# EAGLE design muledrum-noise (EAGLE 6.6.0)

## Sheet 1 of 6: Power
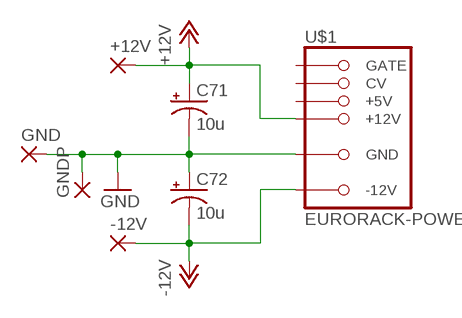
[diagram p0: schematic, sheet 1]

### Parts
+12V  2,54/1,0  [2,54/1,0]
-12V  2,54/1,0  [2,54/1,0]
C71  10u  CPOL-USE2.5-5  [E2,5-5]
C72  10u  CPOL-USE2.5-5  [E2,5-5]
GND  2,54/1,0  [2,54/1,0]
GNDP  2,54/1,0  [2,54/1,0]
U$1  EURORACK-POWER  [PINSHRD_PTH_2X8]

### Nets
+12V: +12V.1(P) C71.+ U$1.+12V@1(+12V) U$1.+12V@2(+12V) ; also sheet 2,3,4,5
-12V: -12V.1(P) C72.- U$1.-12V@1(-12V) U$1.-12V@2(-12V) ; also sheet 2,3,4,5
GND: C71.- C72.+ GND.1(P) GNDP.1(P) U$1.GND@1(GND) U$1.GND@2(GND) U$1.GND@3(GND) U$1.GND@4(GND) U$1.GND@5(GND) U$1.GND@6(GND) ; also sheet 2,3,4,5,6
Unconnected: U$1.+5V@1(+5V) U$1.+5V@2(+5V) U$1.CV@1(CV) U$1.CV@2(CV) U$1.GATE@1(GATE) U$1.GATE@2(GATE)

## Sheet 2 of 6: FNoise1
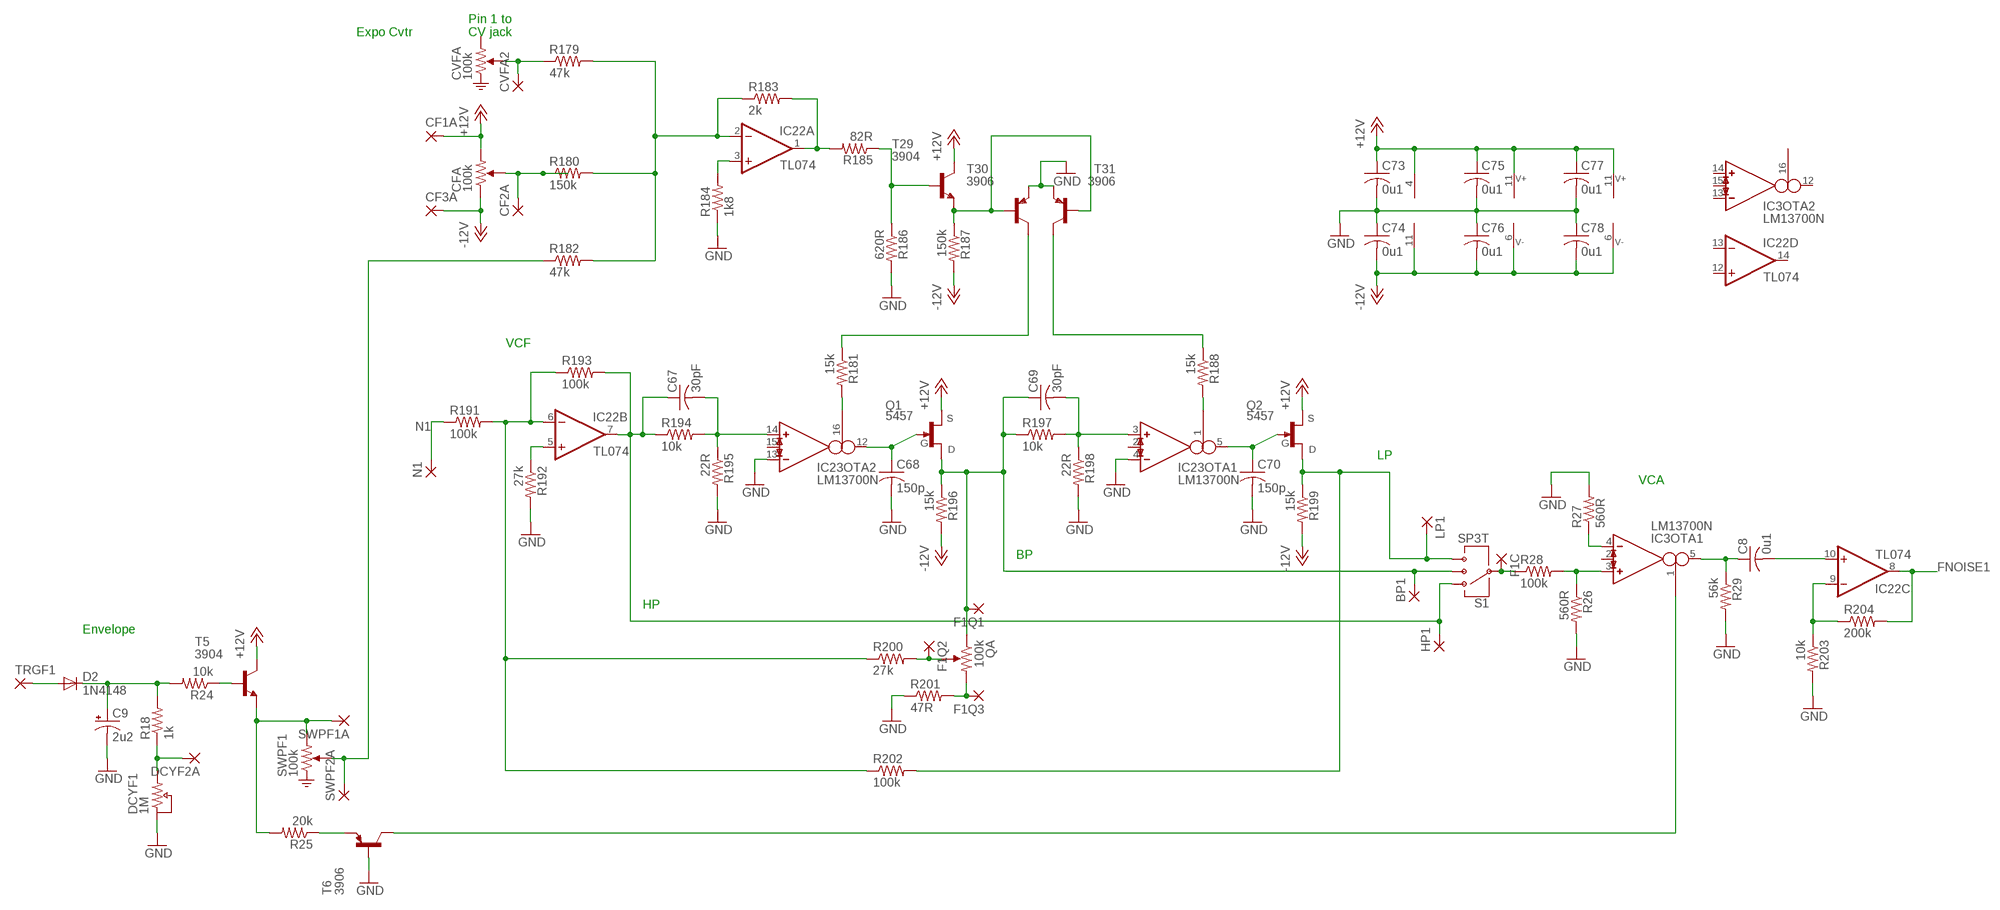
[diagram p1: schematic, sheet 2]

### Parts
BP1  2,54/1,0  [2,54/1,0]
C8  0u1  C-US050-025X075  [C050-025X075]
C9  2u2  CPOL-USE2.5-5  [E2,5-5]
C67  30pF  C-US050-025X075  [C050-025X075]
C68  150p  C-US050-025X075  [C050-025X075]
C69  30pF  C-US050-025X075  [C050-025X075]
C70  150p  C-US050-025X075  [C050-025X075]
C73  0u1  C-US050-025X075  [C050-025X075]
C74  0u1  C-US050-025X075  [C050-025X075]
C75  0u1  C-US050-025X075  [C050-025X075]
C76  0u1  C-US050-025X075  [C050-025X075]
C77  0u1  C-US050-025X075  [C050-025X075]
C78  0u1  C-US050-025X075  [C050-025X075]
CF1A  2,54/1,0  [2,54/1,0]
CF2A  2,54/1,0  [2,54/1,0]
CF3A  2,54/1,0  [2,54/1,0]
CFA  100k  POT  (no package)
CVFA  100k  POT-ATTEN  (no package)
CVFA2  2,54/1,0  [2,54/1,0]
D2  1N4148  1N4148DO35-7  [DO35-7]
DCYF1  1M  POT-RHEO  (no package)
DCYF2A  2,54/1,0  [2,54/1,0]
F1C  2,54/1,0  [2,54/1,0]
F1Q1  2,54/1,0  [2,54/1,0]
F1Q2  2,54/1,0  [2,54/1,0]
F1Q3  2,54/1,0  [2,54/1,0]
HP1  2,54/1,0  [2,54/1,0]
IC3  LM13700N  [DIL16]
IC22  TL074  TL074-TOPP  [DIL14]
IC23  LM13700N  [DIL16]
LP1  2,54/1,0  [2,54/1,0]
N1  2,54/1,0  [2,54/1,0]
Q1  5457  2N5457  [TO92-EBC]
Q2  5457  2N5457  [TO92-EBC]
QA  100k  POT  (no package)
R18  1k  R-US_0207/10  [0207/10]
R24  10k  R-US_0207/10  [0207/10]
R25  20k  R-US_0207/10  [0207/10]
R26  560R  R-US_0207/10  [0207/10]
R27  560R  R-US_0207/10  [0207/10]
R28  100k  R-US_0207/10  [0207/10]
R29  56k  R-US_0207/10  [0207/10]
R179  47k  R-US_0207/10  [0207/10]
R180  150k  R-US_0207/10  [0207/10]
R181  15k  R-US_0207/10  [0207/10]
R182  47k  R-US_0207/10  [0207/10]
R183  2k  R-US_0207/10  [0207/10]
R184  1k8  R-US_0207/10  [0207/10]
R185  82R  R-US_0207/10  [0207/10]
R186  620R  R-US_0207/10  [0207/10]
R187  150k  R-US_0207/10  [0207/10]
R188  15k  R-US_0207/10  [0207/10]
R191  100k  R-US_0207/10  [0207/10]
R192  27k  R-US_0207/10  [0207/10]
R193  100k  R-US_0207/10  [0207/10]
R194  10k  R-US_0207/10  [0207/10]
R195  22R  R-US_0207/10  [0207/10]
R196  15k  R-US_0207/10  [0207/10]
R197  10k  R-US_0207/10  [0207/10]
R198  22R  R-US_0207/10  [0207/10]
R199  15k  R-US_0207/10  [0207/10]
R200  27k  R-US_0207/10  [0207/10]
R201  47R  R-US_0207/10  [0207/10]
R202  100k  R-US_0207/10  [0207/10]
R203  10k  R-US_0207/10  [0207/10]
R204  200k  R-US_0207/10  [0207/10]
S1  SP3T  (no package)
SWPF1  100k  POT-ATTEN  (no package)
SWPF1A  2,54/1,0  [2,54/1,0]
SWPF2A  2,54/1,0  [2,54/1,0]
T5  3904  -NPN-TO92-EBC  [TO92-EBC]
T6  3906  -PNP-TO92-EBC  [TO92-EBC]
T29  3904  -NPN-TO92-EBC  [TO92-EBC]
T30  3906  -PNP-TO92-EBC  [TO92-EBC]
T31  3906  -PNP-TO92-EBC  [TO92-EBC]
TRGF1  2,54/1,0  [2,54/1,0]

### Nets
+12V: C73.1 C75.1 C77.1 CF1A.1(P) CFA.1 IC3.11 IC22.4(P:V+) IC23.11 Q1.E(S) Q2.E(S) T5.C T29.C ; also sheet 1,3,4,5
-12V: C74.2 C76.2 C78.2 CF3A.1(P) CFA.3 IC3.6 IC22.11(P:V-) IC23.6 R187.2 R196.2 R199.2 ; also sheet 1,3,4,5
FNOISE1: IC22.8(C:OUT) R204.2 ; also sheet 6
GND: C9.- C68.2 C70.2 C73.2 C74.1 C75.2 C76.1 C77.2 C78.1 DCYF1.3 IC23.4(OTA1:IN_N) IC23.13(OTA2:IN_N) R26.2 R27.2 R29.2 R184.1 R186.2 R192.2 R195.2 R198.2 R201.1 R203.2 T6.B T30.E T31.E ; also sheet 1,3,4,5,6
N1: N1.1(P) R191.1
N$29: C9.+ D2.C R18.2 R24.2
N$30: R24.1 T5.B
N$31: R25.2 SWPF1.1 SWPF1A.1(P) T5.E
N$32: R25.1 T6.E
N$33: F1C.1(P) R28.1 S1.3
N$34: IC3.3(OTA1:IN_P) R26.1 R28.2
N$35: IC3.4(OTA1:IN_N) R27.1
N$36: C8.1 IC3.5(OTA1:OUT) R29.1
N$37: D2.A TRGF1.1(P)
N$38: DCYF1.1 DCYF2A.1(P) R18.1
N$39: R182.1 SWPF1.2 SWPF2A.1(P)
N$105: CVFA2.1(P) CVFA.2 R179.1
N$223: CF2A.1(P) CFA.2 R180.1
N$224: IC22.2(A:-IN) R179.2 R180.2 R182.2 R183.1
N$225: C8.2 IC22.10(C:+IN)
N$226: IC22.1(A:OUT) R183.2 R185.2
N$227: IC22.3(A:+IN) R184.2
N$230: R185.1 R186.1 T29.B
N$231: R187.1 T29.E T30.B T31.B
N$232: R181.1 T30.C
N$233: R188.1 T31.C
N$235: IC22.6(B:-IN) R191.2 R193.1 R200.1 R202.1
N$236: IC22.5(B:+IN) R192.1
N$237: IC3.1(OTA1:I_BIAS) T6.C
N$238: C67.2 IC23.14(OTA2:IN_P) R194.2 R195.1
N$239: C68.1 IC23.12(OTA2:OUT) Q1.C(G)
N$240: C70.1 IC23.5(OTA1:OUT) Q2.C(G)
N$241: IC23.16(OTA2:I_BIAS) R181.2
N$242: IC22.9(C:-IN) R203.1 R204.1
N$243: C69.2 IC23.3(OTA1:IN_P) R197.2 R198.1
N$245: IC23.1(OTA1:I_BIAS) R188.2
N$246: F1Q2.1(P) QA.2 R200.2
N$247: F1Q3.1(P) QA.1 R201.2
N$248: C67.1 HP1.1(P) IC22.7(B:OUT) R193.2 R194.1 S1.1
N$249: BP1.1(P) C69.1 F1Q1.1(P) Q1.B(D) QA.3 R196.1 R197.1 S1.2
N$250: LP1.1(P) Q2.B(D) R199.1 R202.2 S1.4
Unconnected: CVFA.1 IC3.2(OTA1:I_DIODE) IC3.7(BUF1:B) IC3.8(BUF1:E) IC3.9(BUF2:E) IC3.10(BUF2:B) IC3.12(OTA2:OUT) IC3.13(OTA2:IN_N) IC3.14(OTA2:IN_P) IC3.15(OTA2:I_DIODE) IC3.16(OTA2:I_BIAS) IC22.12(D:+IN) IC22.13(D:-IN) IC22.14(D:OUT) IC23.2(OTA1:I_DIODE) IC23.7(BUF1:B) IC23.8(BUF1:E) IC23.9(BUF2:E) IC23.10(BUF2:B) IC23.15(OTA2:I_DIODE)

### Notes on the sheet
- Expo Cvtr
- Pin 1 to
  CV jack
- VCF
- LP
- VCA
- BP
- HP
- Envelope

## Sheet 3 of 6: FNoise2
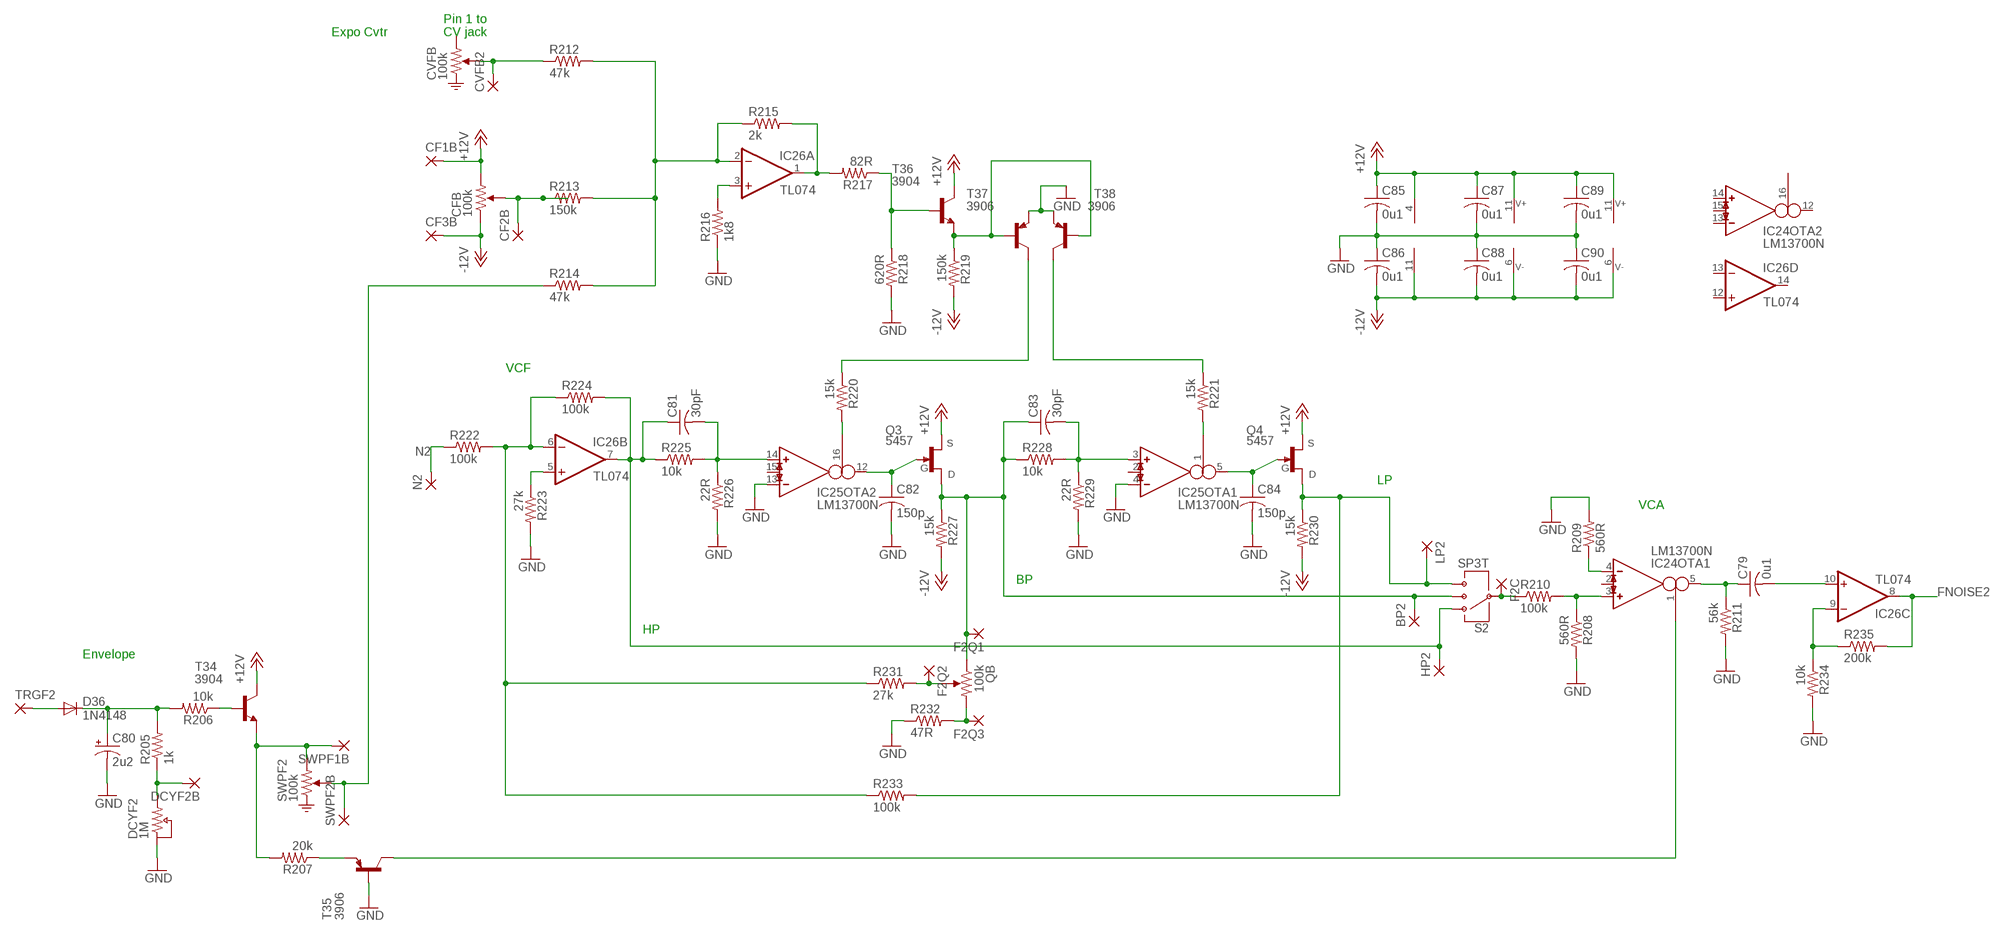
[diagram p2: schematic, sheet 3]

### Parts
BP2  2,54/1,0  [2,54/1,0]
C79  0u1  C-US050-025X075  [C050-025X075]
C80  2u2  CPOL-USE2.5-5  [E2,5-5]
C81  30pF  C-US050-025X075  [C050-025X075]
C82  150p  C-US050-025X075  [C050-025X075]
C83  30pF  C-US050-025X075  [C050-025X075]
C84  150p  C-US050-025X075  [C050-025X075]
C85  0u1  C-US050-025X075  [C050-025X075]
C86  0u1  C-US050-025X075  [C050-025X075]
C87  0u1  C-US050-025X075  [C050-025X075]
C88  0u1  C-US050-025X075  [C050-025X075]
C89  0u1  C-US050-025X075  [C050-025X075]
C90  0u1  C-US050-025X075  [C050-025X075]
CF1B  2,54/1,0  [2,54/1,0]
CF2B  2,54/1,0  [2,54/1,0]
CF3B  2,54/1,0  [2,54/1,0]
CFB  100k  POT  (no package)
CVFB  100k  POT-ATTEN  (no package)
CVFB2  2,54/1,0  [2,54/1,0]
D36  1N4148  1N4148DO35-7  [DO35-7]
DCYF2  1M  POT-RHEO  (no package)
DCYF2B  2,54/1,0  [2,54/1,0]
F2C  2,54/1,0  [2,54/1,0]
F2Q1  2,54/1,0  [2,54/1,0]
F2Q2  2,54/1,0  [2,54/1,0]
F2Q3  2,54/1,0  [2,54/1,0]
HP2  2,54/1,0  [2,54/1,0]
IC24  LM13700N  [DIL16]
IC25  LM13700N  [DIL16]
IC26  TL074  TL074-TOPP  [DIL14]
LP2  2,54/1,0  [2,54/1,0]
N2  2,54/1,0  [2,54/1,0]
Q3  5457  2N5457  [TO92-EBC]
Q4  5457  2N5457  [TO92-EBC]
QB  100k  POT  (no package)
R205  1k  R-US_0207/10  [0207/10]
R206  10k  R-US_0207/10  [0207/10]
R207  20k  R-US_0207/10  [0207/10]
R208  560R  R-US_0207/10  [0207/10]
R209  560R  R-US_0207/10  [0207/10]
R210  100k  R-US_0207/10  [0207/10]
R211  56k  R-US_0207/10  [0207/10]
R212  47k  R-US_0207/10  [0207/10]
R213  150k  R-US_0207/10  [0207/10]
R214  47k  R-US_0207/10  [0207/10]
R215  2k  R-US_0207/10  [0207/10]
R216  1k8  R-US_0207/10  [0207/10]
R217  82R  R-US_0207/10  [0207/10]
R218  620R  R-US_0207/10  [0207/10]
R219  150k  R-US_0207/10  [0207/10]
R220  15k  R-US_0207/10  [0207/10]
R221  15k  R-US_0207/10  [0207/10]
R222  100k  R-US_0207/10  [0207/10]
R223  27k  R-US_0207/10  [0207/10]
R224  100k  R-US_0207/10  [0207/10]
R225  10k  R-US_0207/10  [0207/10]
R226  22R  R-US_0207/10  [0207/10]
R227  15k  R-US_0207/10  [0207/10]
R228  10k  R-US_0207/10  [0207/10]
R229  22R  R-US_0207/10  [0207/10]
R230  15k  R-US_0207/10  [0207/10]
R231  27k  R-US_0207/10  [0207/10]
R232  47R  R-US_0207/10  [0207/10]
R233  100k  R-US_0207/10  [0207/10]
R234  10k  R-US_0207/10  [0207/10]
R235  200k  R-US_0207/10  [0207/10]
S2  SP3T  (no package)
SWPF1B  2,54/1,0  [2,54/1,0]
SWPF2  100k  POT-ATTEN  (no package)
SWPF2B  2,54/1,0  [2,54/1,0]
T34  3904  -NPN-TO92-EBC  [TO92-EBC]
T35  3906  -PNP-TO92-EBC  [TO92-EBC]
T36  3904  -NPN-TO92-EBC  [TO92-EBC]
T37  3906  -PNP-TO92-EBC  [TO92-EBC]
T38  3906  -PNP-TO92-EBC  [TO92-EBC]
TRGF2  2,54/1,0  [2,54/1,0]

### Nets
+12V: C85.1 C87.1 C89.1 CF1B.1(P) CFB.1 IC24.11 IC25.11 IC26.4(P:V+) Q3.E(S) Q4.E(S) T34.C T36.C ; also sheet 1,2,4,5
-12V: C86.2 C88.2 C90.2 CF3B.1(P) CFB.3 IC24.6 IC25.6 IC26.11(P:V-) R219.2 R227.2 R230.2 ; also sheet 1,2,4,5
FNOISE2: IC26.8(C:OUT) R235.2 ; also sheet 6
GND: C80.- C82.2 C84.2 C85.2 C86.1 C87.2 C88.1 C89.2 C90.1 DCYF2.3 IC25.4(OTA1:IN_N) IC25.13(OTA2:IN_N) R208.2 R209.2 R211.2 R216.1 R218.2 R223.2 R226.2 R229.2 R232.1 R234.2 T35.B T37.E T38.E ; also sheet 1,2,4,5,6
N2: N2.1(P) R222.1
N$106: CVFB2.1(P) CVFB.2 R212.1
N$255: C80.+ D36.C R205.2 R206.2
N$256: R206.1 T34.B
N$257: R207.2 SWPF1B.1(P) SWPF2.1 T34.E
N$258: R207.1 T35.E
N$259: IC24.3(OTA1:IN_P) R208.1 R210.2
N$260: IC24.4(OTA1:IN_N) R209.1
N$261: C79.1 IC24.5(OTA1:OUT) R211.1
N$262: D36.A TRGF2.1(P)
N$263: DCYF2.1 DCYF2B.1(P) R205.1
N$264: R214.1 SWPF2.2 SWPF2B.1(P)
N$266: IC26.2(A:-IN) R212.2 R213.2 R214.2 R215.1
N$267: IC26.1(A:OUT) R215.2 R217.2
N$268: IC26.3(A:+IN) R216.2
N$269: R217.1 R218.1 T36.B
N$270: R219.1 T36.E T37.B T38.B
N$271: R220.1 T37.C
N$272: R221.1 T38.C
N$273: CF2B.1(P) CFB.2 R213.1
N$274: IC26.6(B:-IN) R222.2 R224.1 R231.1 R233.1
N$275: IC26.5(B:+IN) R223.1
N$276: C81.2 IC25.14(OTA2:IN_P) R225.2 R226.1
N$277: C82.1 IC25.12(OTA2:OUT) Q3.C(G)
N$278: IC25.16(OTA2:I_BIAS) R220.2
N$279: C83.2 IC25.3(OTA1:IN_P) R228.2 R229.1
N$280: C84.1 IC25.5(OTA1:OUT) Q4.C(G)
N$281: IC25.1(OTA1:I_BIAS) R221.2
N$282: F2Q2.1(P) QB.2 R231.2
N$283: F2Q3.1(P) QB.1 R232.2
N$284: C81.1 HP2.1(P) IC26.7(B:OUT) R224.2 R225.1 S2.1
N$285: BP2.1(P) C83.1 F2Q1.1(P) Q3.B(D) QB.3 R227.1 R228.1 S2.2
N$286: LP2.1(P) Q4.B(D) R230.1 R233.2 S2.4
N$287: F2C.1(P) R210.1 S2.3
N$288: IC24.1(OTA1:I_BIAS) T35.C
N$289: C79.2 IC26.10(C:+IN)
N$290: IC26.9(C:-IN) R234.1 R235.1
Unconnected: CVFB.1 IC24.2(OTA1:I_DIODE) IC24.7(BUF1:B) IC24.8(BUF1:E) IC24.9(BUF2:E) IC24.10(BUF2:B) IC24.12(OTA2:OUT) IC24.13(OTA2:IN_N) IC24.14(OTA2:IN_P) IC24.15(OTA2:I_DIODE) IC24.16(OTA2:I_BIAS) IC25.2(OTA1:I_DIODE) IC25.7(BUF1:B) IC25.8(BUF1:E) IC25.9(BUF2:E) IC25.10(BUF2:B) IC25.15(OTA2:I_DIODE) IC26.12(D:+IN) IC26.13(D:-IN) IC26.14(D:OUT)

### Notes on the sheet
- Expo Cvtr
- Pin 1 to
  CV jack
- VCF
- LP
- VCA
- BP
- HP
- Envelope

## Sheet 4 of 6: FNoise3
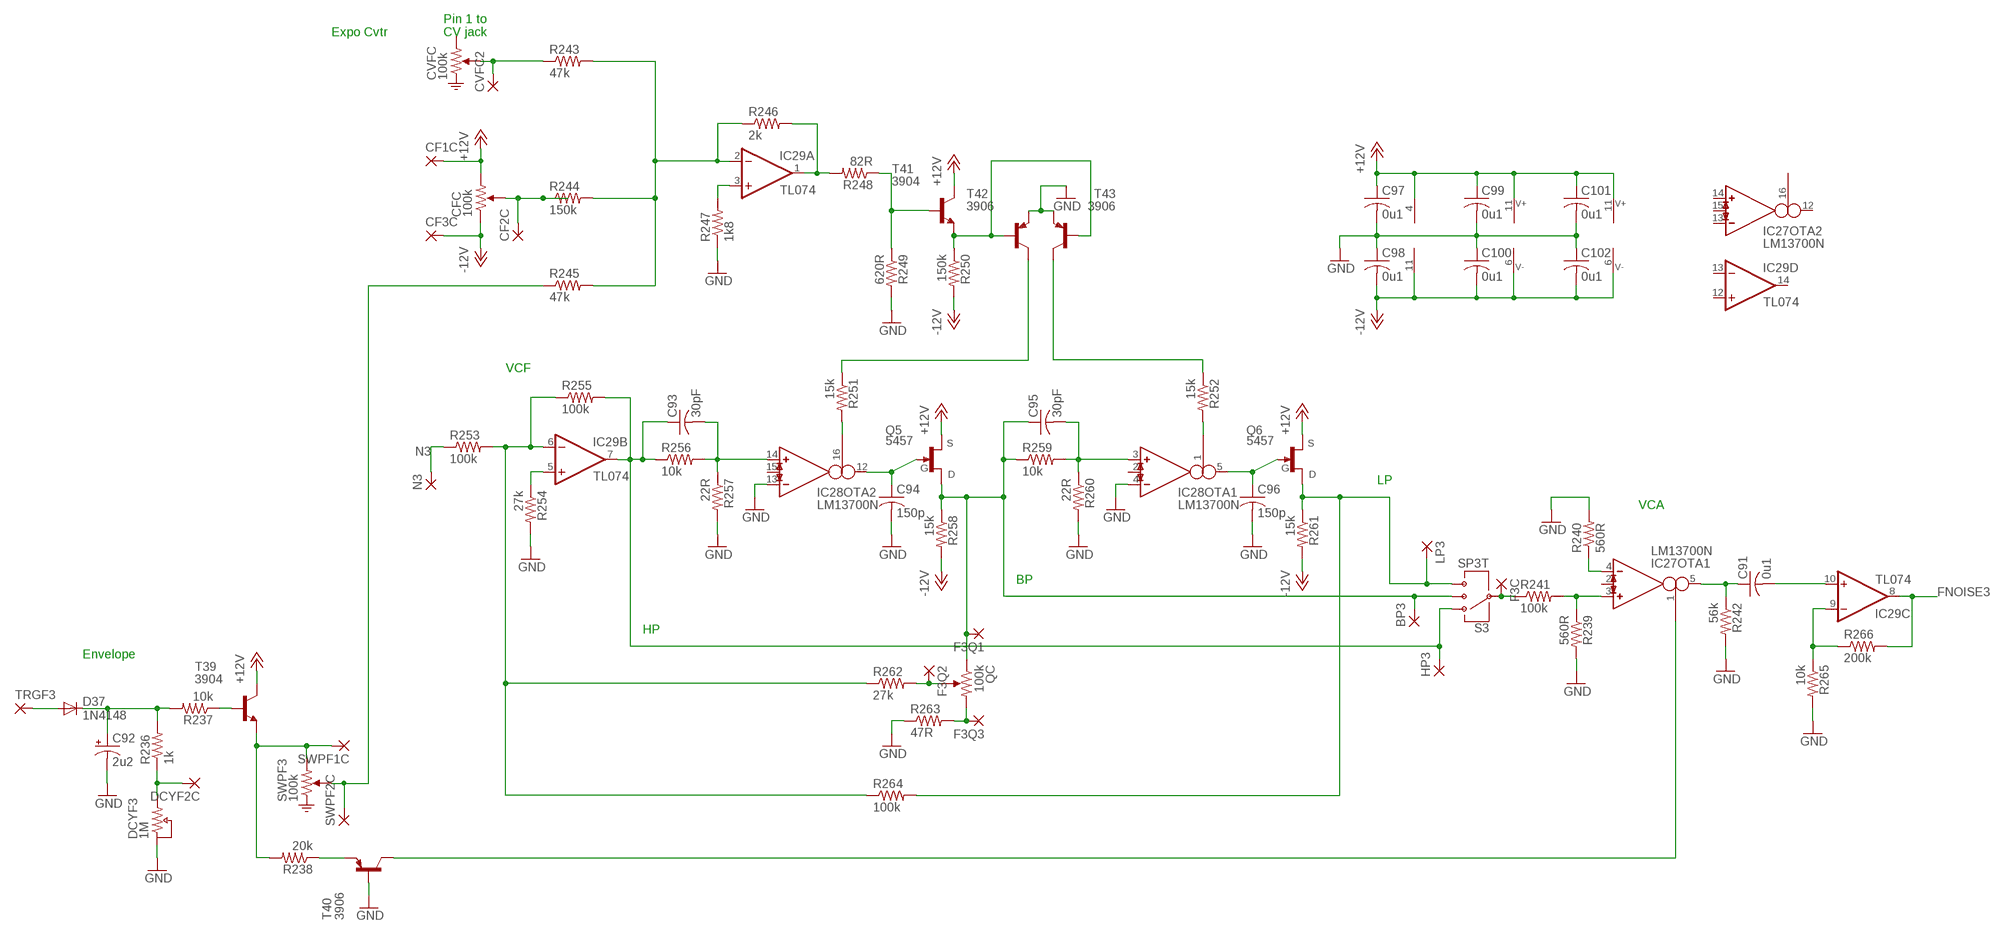
[diagram p3: schematic, sheet 4]

### Parts
BP3  2,54/1,0  [2,54/1,0]
C91  0u1  C-US050-025X075  [C050-025X075]
C92  2u2  CPOL-USE2.5-5  [E2,5-5]
C93  30pF  C-US050-025X075  [C050-025X075]
C94  150p  C-US050-025X075  [C050-025X075]
C95  30pF  C-US050-025X075  [C050-025X075]
C96  150p  C-US050-025X075  [C050-025X075]
C97  0u1  C-US050-025X075  [C050-025X075]
C98  0u1  C-US050-025X075  [C050-025X075]
C99  0u1  C-US050-025X075  [C050-025X075]
C100  0u1  C-US050-025X075  [C050-025X075]
C101  0u1  C-US050-025X075  [C050-025X075]
C102  0u1  C-US050-025X075  [C050-025X075]
CF1C  2,54/1,0  [2,54/1,0]
CF2C  2,54/1,0  [2,54/1,0]
CF3C  2,54/1,0  [2,54/1,0]
CFC  100k  POT  (no package)
CVFC  100k  POT-ATTEN  (no package)
CVFC2  2,54/1,0  [2,54/1,0]
D37  1N4148  1N4148DO35-7  [DO35-7]
DCYF2C  2,54/1,0  [2,54/1,0]
DCYF3  1M  POT-RHEO  (no package)
F3C  2,54/1,0  [2,54/1,0]
F3Q1  2,54/1,1  [2,54/1,1]
F3Q2  2,54/1,1  [2,54/1,1]
F3Q3  2,54/1,1  [2,54/1,1]
HP3  2,54/1,0  [2,54/1,0]
IC27  LM13700N  [DIL16]
IC28  LM13700N  [DIL16]
IC29  TL074  TL074-TOPP  [DIL14]
LP3  2,54/1,0  [2,54/1,0]
N3  2,54/1,0  [2,54/1,0]
Q5  5457  2N5457  [TO92-EBC]
Q6  5457  2N5457  [TO92-EBC]
QC  100k  POT  (no package)
R236  1k  R-US_0207/10  [0207/10]
R237  10k  R-US_0207/10  [0207/10]
R238  20k  R-US_0207/10  [0207/10]
R239  560R  R-US_0207/10  [0207/10]
R240  560R  R-US_0207/10  [0207/10]
R241  100k  R-US_0207/10  [0207/10]
R242  56k  R-US_0207/10  [0207/10]
R243  47k  R-US_0207/10  [0207/10]
R244  150k  R-US_0207/10  [0207/10]
R245  47k  R-US_0207/10  [0207/10]
R246  2k  R-US_0207/10  [0207/10]
R247  1k8  R-US_0207/10  [0207/10]
R248  82R  R-US_0207/10  [0207/10]
R249  620R  R-US_0207/10  [0207/10]
R250  150k  R-US_0207/10  [0207/10]
R251  15k  R-US_0207/10  [0207/10]
R252  15k  R-US_0207/10  [0207/10]
R253  100k  R-US_0207/10  [0207/10]
R254  27k  R-US_0207/10  [0207/10]
R255  100k  R-US_0207/10  [0207/10]
R256  10k  R-US_0207/10  [0207/10]
R257  22R  R-US_0207/10  [0207/10]
R258  15k  R-US_0207/10  [0207/10]
R259  10k  R-US_0207/10  [0207/10]
R260  22R  R-US_0207/10  [0207/10]
R261  15k  R-US_0207/10  [0207/10]
R262  27k  R-US_0207/10  [0207/10]
R263  47R  R-US_0207/10  [0207/10]
R264  100k  R-US_0207/10  [0207/10]
R265  10k  R-US_0207/10  [0207/10]
R266  200k  R-US_0207/10  [0207/10]
S3  SP3T  (no package)
SWPF1C  2,54/1,0  [2,54/1,0]
SWPF2C  2,54/1,0  [2,54/1,0]
SWPF3  100k  POT-ATTEN  (no package)
T39  3904  -NPN-TO92-EBC  [TO92-EBC]
T40  3906  -PNP-TO92-EBC  [TO92-EBC]
T41  3904  -NPN-TO92-EBC  [TO92-EBC]
T42  3906  -PNP-TO92-EBC  [TO92-EBC]
T43  3906  -PNP-TO92-EBC  [TO92-EBC]
TRGF3  2,54/1,0  [2,54/1,0]

### Nets
+12V: C97.1 C99.1 C101.1 CF1C.1(P) CFC.1 IC27.11 IC28.11 IC29.4(P:V+) Q5.E(S) Q6.E(S) T39.C T41.C ; also sheet 1,2,3,5
-12V: C98.2 C100.2 C102.2 CF3C.1(P) CFC.3 IC27.6 IC28.6 IC29.11(P:V-) R250.2 R258.2 R261.2 ; also sheet 1,2,3,5
FNOISE3: IC29.8(C:OUT) R266.2 ; also sheet 6
GND: C92.- C94.2 C96.2 C97.2 C98.1 C99.2 C100.1 C101.2 C102.1 DCYF3.3 IC28.4(OTA1:IN_N) IC28.13(OTA2:IN_N) R239.2 R240.2 R242.2 R247.1 R249.2 R254.2 R257.2 R260.2 R263.1 R265.2 T40.B T42.E T43.E ; also sheet 1,2,3,5,6
N3: N3.1(P) R253.1
N$107: CVFC2.1(P) CVFC.2 R243.1
N$244: C92.+ D37.C R236.2 R237.2
N$251: R237.1 T39.B
N$252: R238.2 SWPF1C.1(P) SWPF3.1 T39.E
N$253: R238.1 T40.E
N$254: IC27.3(OTA1:IN_P) R239.1 R241.2
N$291: IC27.4(OTA1:IN_N) R240.1
N$292: C91.1 IC27.5(OTA1:OUT) R242.1
N$293: D37.A TRGF3.1(P)
N$294: DCYF2C.1(P) DCYF3.1 R236.1
N$295: R245.1 SWPF2C.1(P) SWPF3.2
N$297: IC29.2(A:-IN) R243.2 R244.2 R245.2 R246.1
N$298: IC29.1(A:OUT) R246.2 R248.2
N$299: IC29.3(A:+IN) R247.2
N$300: R248.1 R249.1 T41.B
N$301: R250.1 T41.E T42.B T43.B
N$302: R251.1 T42.C
N$303: R252.1 T43.C
N$304: CF2C.1(P) CFC.2 R244.1
N$305: IC29.6(B:-IN) R253.2 R255.1 R262.1 R264.1
N$306: IC29.5(B:+IN) R254.1
N$307: C93.2 IC28.14(OTA2:IN_P) R256.2 R257.1
N$308: C94.1 IC28.12(OTA2:OUT) Q5.C(G)
N$309: IC28.16(OTA2:I_BIAS) R251.2
N$310: C95.2 IC28.3(OTA1:IN_P) R259.2 R260.1
N$311: C96.1 IC28.5(OTA1:OUT) Q6.C(G)
N$312: IC28.1(OTA1:I_BIAS) R252.2
N$313: F3Q2.1(P) QC.2 R262.2
N$314: F3Q3.1(P) QC.1 R263.2
N$315: C93.1 HP3.1(P) IC29.7(B:OUT) R255.2 R256.1 S3.1
N$316: BP3.1(P) C95.1 F3Q1.1(P) Q5.B(D) QC.3 R258.1 R259.1 S3.2
N$317: LP3.1(P) Q6.B(D) R261.1 R264.2 S3.4
N$318: F3C.1(P) R241.1 S3.3
N$319: IC27.1(OTA1:I_BIAS) T40.C
N$320: C91.2 IC29.10(C:+IN)
N$321: IC29.9(C:-IN) R265.1 R266.1
Unconnected: CVFC.1 IC27.2(OTA1:I_DIODE) IC27.7(BUF1:B) IC27.8(BUF1:E) IC27.9(BUF2:E) IC27.10(BUF2:B) IC27.12(OTA2:OUT) IC27.13(OTA2:IN_N) IC27.14(OTA2:IN_P) IC27.15(OTA2:I_DIODE) IC27.16(OTA2:I_BIAS) IC28.2(OTA1:I_DIODE) IC28.7(BUF1:B) IC28.8(BUF1:E) IC28.9(BUF2:E) IC28.10(BUF2:B) IC28.15(OTA2:I_DIODE) IC29.12(D:+IN) IC29.13(D:-IN) IC29.14(D:OUT)

### Notes on the sheet
- Expo Cvtr
- Pin 1 to
  CV jack
- VCF
- LP
- VCA
- BP
- HP
- Envelope

## Sheet 5 of 6: FNoise4
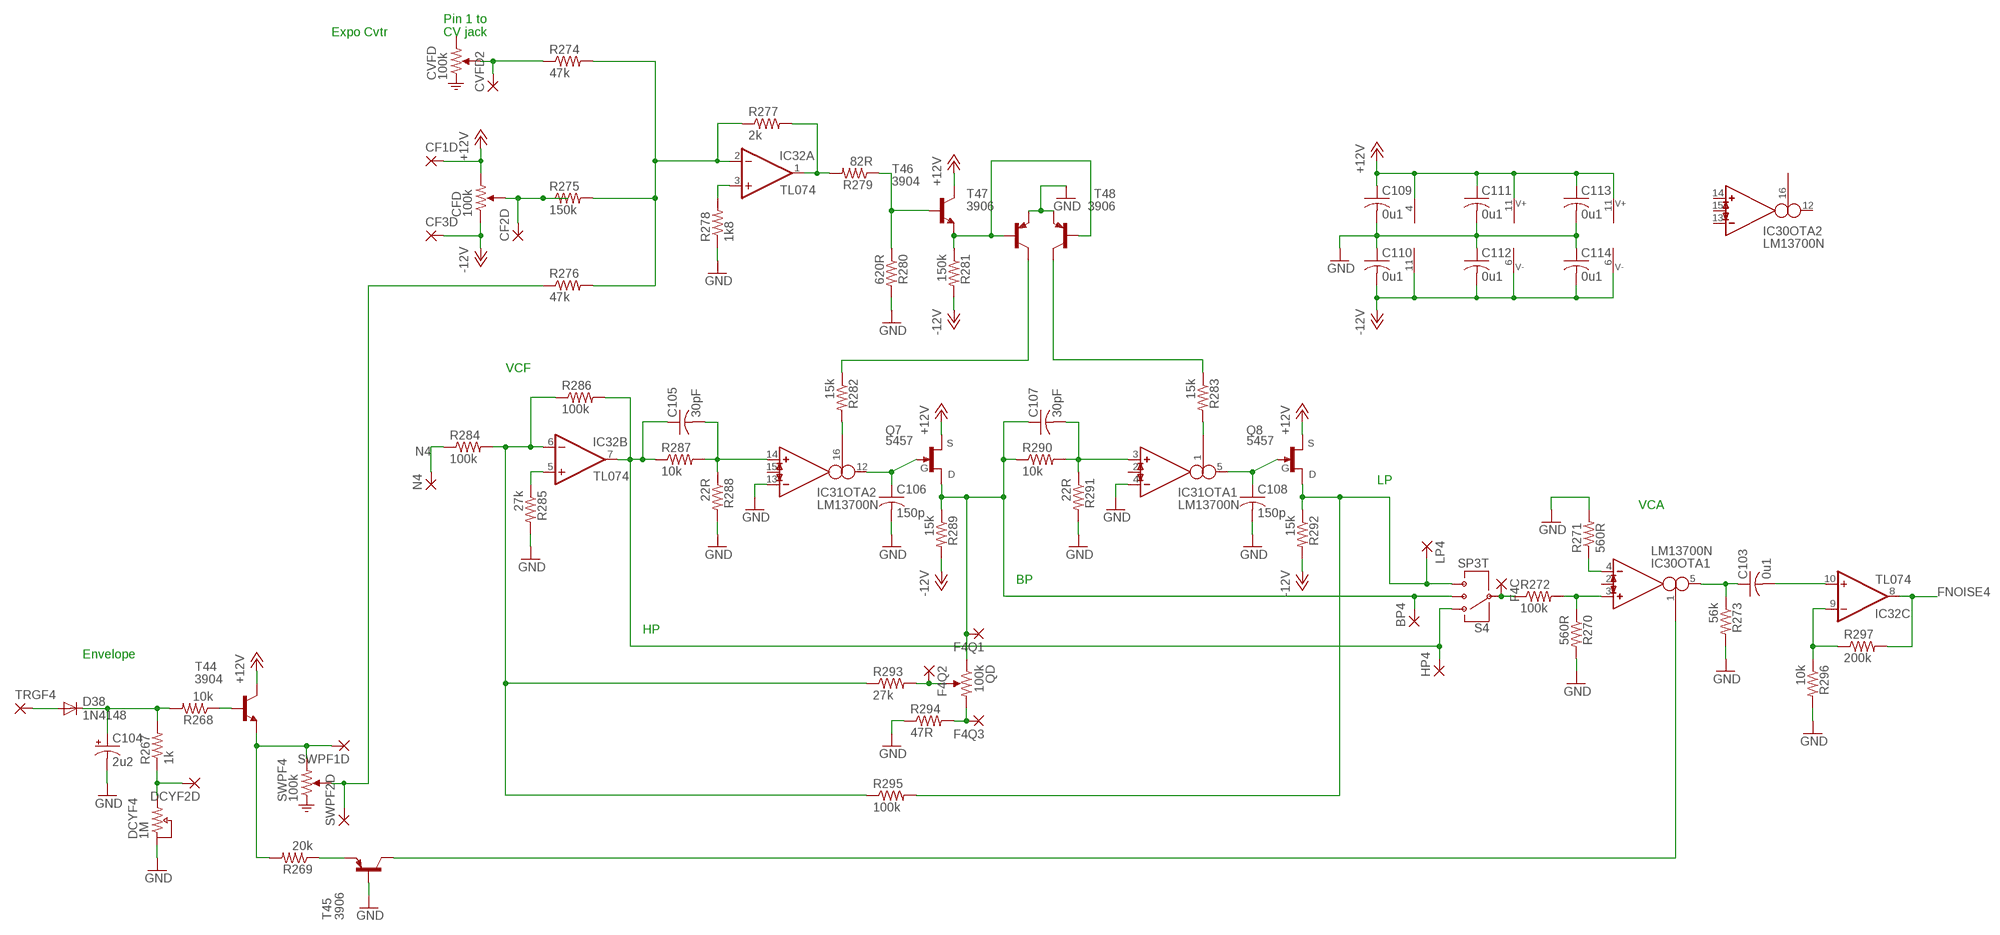
[diagram p4: schematic, sheet 5]

### Parts
BP4  2,54/1,0  [2,54/1,0]
C103  0u1  C-US050-025X075  [C050-025X075]
C104  2u2  CPOL-USE2.5-5  [E2,5-5]
C105  30pF  C-US050-025X075  [C050-025X075]
C106  150p  C-US050-025X075  [C050-025X075]
C107  30pF  C-US050-025X075  [C050-025X075]
C108  150p  C-US050-025X075  [C050-025X075]
C109  0u1  C-US050-025X075  [C050-025X075]
C110  0u1  C-US050-025X075  [C050-025X075]
C111  0u1  C-US050-025X075  [C050-025X075]
C112  0u1  C-US050-025X075  [C050-025X075]
C113  0u1  C-US050-025X075  [C050-025X075]
C114  0u1  C-US050-025X075  [C050-025X075]
CF1D  2,54/1,0  [2,54/1,0]
CF2D  2,54/1,0  [2,54/1,0]
CF3D  2,54/1,0  [2,54/1,0]
CFD  100k  POT  (no package)
CVFD  100k  POT-ATTEN  (no package)
CVFD2  2,54/1,0  [2,54/1,0]
D38  1N4148  1N4148DO35-7  [DO35-7]
DCYF2D  2,54/1,0  [2,54/1,0]
DCYF4  1M  POT-RHEO  (no package)
F4C  2,54/1,0  [2,54/1,0]
F4Q1  2,54/1,0  [2,54/1,0]
F4Q2  2,54/1,0  [2,54/1,0]
F4Q3  2,54/1,0  [2,54/1,0]
HP4  2,54/1,0  [2,54/1,0]
IC30  LM13700N  [DIL16]
IC31  LM13700N  [DIL16]
IC32  TL074  TL074-TOPP  [DIL14]
LP4  2,54/1,0  [2,54/1,0]
N4  2,54/1,0  [2,54/1,0]
Q7  5457  2N5457  [TO92-EBC]
Q8  5457  2N5457  [TO92-EBC]
QD  100k  POT  (no package)
R267  1k  R-US_0207/10  [0207/10]
R268  10k  R-US_0207/10  [0207/10]
R269  20k  R-US_0207/10  [0207/10]
R270  560R  R-US_0207/10  [0207/10]
R271  560R  R-US_0207/10  [0207/10]
R272  100k  R-US_0207/10  [0207/10]
R273  56k  R-US_0207/10  [0207/10]
R274  47k  R-US_0207/10  [0207/10]
R275  150k  R-US_0207/10  [0207/10]
R276  47k  R-US_0207/10  [0207/10]
R277  2k  R-US_0207/10  [0207/10]
R278  1k8  R-US_0207/10  [0207/10]
R279  82R  R-US_0207/10  [0207/10]
R280  620R  R-US_0207/10  [0207/10]
R281  150k  R-US_0207/10  [0207/10]
R282  15k  R-US_0207/10  [0207/10]
R283  15k  R-US_0207/10  [0207/10]
R284  100k  R-US_0207/10  [0207/10]
R285  27k  R-US_0207/10  [0207/10]
R286  100k  R-US_0207/10  [0207/10]
R287  10k  R-US_0207/10  [0207/10]
R288  22R  R-US_0207/10  [0207/10]
R289  15k  R-US_0207/10  [0207/10]
R290  10k  R-US_0207/10  [0207/10]
R291  22R  R-US_0207/10  [0207/10]
R292  15k  R-US_0207/10  [0207/10]
R293  27k  R-US_0207/10  [0207/10]
R294  47R  R-US_0207/10  [0207/10]
R295  100k  R-US_0207/10  [0207/10]
R296  10k  R-US_0207/10  [0207/10]
R297  200k  R-US_0207/10  [0207/10]
S4  SP3T  (no package)
SWPF1D  2,54/1,0  [2,54/1,0]
SWPF2D  2,54/1,0  [2,54/1,0]
SWPF4  100k  POT-ATTEN  (no package)
T44  3904  -NPN-TO92-EBC  [TO92-EBC]
T45  3906  -PNP-TO92-EBC  [TO92-EBC]
T46  3904  -NPN-TO92-EBC  [TO92-EBC]
T47  3906  -PNP-TO92-EBC  [TO92-EBC]
T48  3906  -PNP-TO92-EBC  [TO92-EBC]
TRGF4  2,54/1,0  [2,54/1,0]

### Nets
+12V: C109.1 C111.1 C113.1 CF1D.1(P) CFD.1 IC30.11 IC31.11 IC32.4(P:V+) Q7.E(S) Q8.E(S) T44.C T46.C ; also sheet 1,2,3,4
-12V: C110.2 C112.2 C114.2 CF3D.1(P) CFD.3 IC30.6 IC31.6 IC32.11(P:V-) R281.2 R289.2 R292.2 ; also sheet 1,2,3,4
FNOISE4: IC32.8(C:OUT) R297.2 ; also sheet 6
GND: C104.- C106.2 C108.2 C109.2 C110.1 C111.2 C112.1 C113.2 C114.1 DCYF4.3 IC31.4(OTA1:IN_N) IC31.13(OTA2:IN_N) R270.2 R271.2 R273.2 R278.1 R280.2 R285.2 R288.2 R291.2 R294.1 R296.2 T45.B T47.E T48.E ; also sheet 1,2,3,4,6
N4: N4.1(P) R284.1
N$108: CVFD2.1(P) CVFD.2 R274.1
N$322: C104.+ D38.C R267.2 R268.2
N$323: R268.1 T44.B
N$324: R269.2 SWPF1D.1(P) SWPF4.1 T44.E
N$325: R269.1 T45.E
N$326: IC30.3(OTA1:IN_P) R270.1 R272.2
N$327: IC30.4(OTA1:IN_N) R271.1
N$328: C103.1 IC30.5(OTA1:OUT) R273.1
N$329: D38.A TRGF4.1(P)
N$330: DCYF2D.1(P) DCYF4.1 R267.1
N$331: R276.1 SWPF2D.1(P) SWPF4.2
N$333: IC32.2(A:-IN) R274.2 R275.2 R276.2 R277.1
N$334: IC32.1(A:OUT) R277.2 R279.2
N$335: IC32.3(A:+IN) R278.2
N$336: R279.1 R280.1 T46.B
N$337: R281.1 T46.E T47.B T48.B
N$338: R282.1 T47.C
N$339: R283.1 T48.C
N$340: CF2D.1(P) CFD.2 R275.1
N$341: IC32.6(B:-IN) R284.2 R286.1 R293.1 R295.1
N$342: IC32.5(B:+IN) R285.1
N$343: C105.2 IC31.14(OTA2:IN_P) R287.2 R288.1
N$344: C106.1 IC31.12(OTA2:OUT) Q7.C(G)
N$345: IC31.16(OTA2:I_BIAS) R282.2
N$346: C107.2 IC31.3(OTA1:IN_P) R290.2 R291.1
N$347: C108.1 IC31.5(OTA1:OUT) Q8.C(G)
N$348: IC31.1(OTA1:I_BIAS) R283.2
N$349: F4Q2.1(P) QD.2 R293.2
N$350: F4Q3.1(P) QD.1 R294.2
N$351: C105.1 HP4.1(P) IC32.7(B:OUT) R286.2 R287.1 S4.1
N$352: BP4.1(P) C107.1 F4Q1.1(P) Q7.B(D) QD.3 R289.1 R290.1 S4.2
N$353: LP4.1(P) Q8.B(D) R292.1 R295.2 S4.4
N$354: F4C.1(P) R272.1 S4.3
N$355: IC30.1(OTA1:I_BIAS) T45.C
N$356: C103.2 IC32.10(C:+IN)
N$357: IC32.9(C:-IN) R296.1 R297.1
Unconnected: CVFD.1 IC30.2(OTA1:I_DIODE) IC30.7(BUF1:B) IC30.8(BUF1:E) IC30.9(BUF2:E) IC30.10(BUF2:B) IC30.12(OTA2:OUT) IC30.13(OTA2:IN_N) IC30.14(OTA2:IN_P) IC30.15(OTA2:I_DIODE) IC30.16(OTA2:I_BIAS) IC31.2(OTA1:I_DIODE) IC31.7(BUF1:B) IC31.8(BUF1:E) IC31.9(BUF2:E) IC31.10(BUF2:B) IC31.15(OTA2:I_DIODE)

### Notes on the sheet
- Expo Cvtr
- Pin 1 to
  CV jack
- VCF
- LP
- VCA
- BP
- HP
- Envelope

## Sheet 6 of 6: Mixer
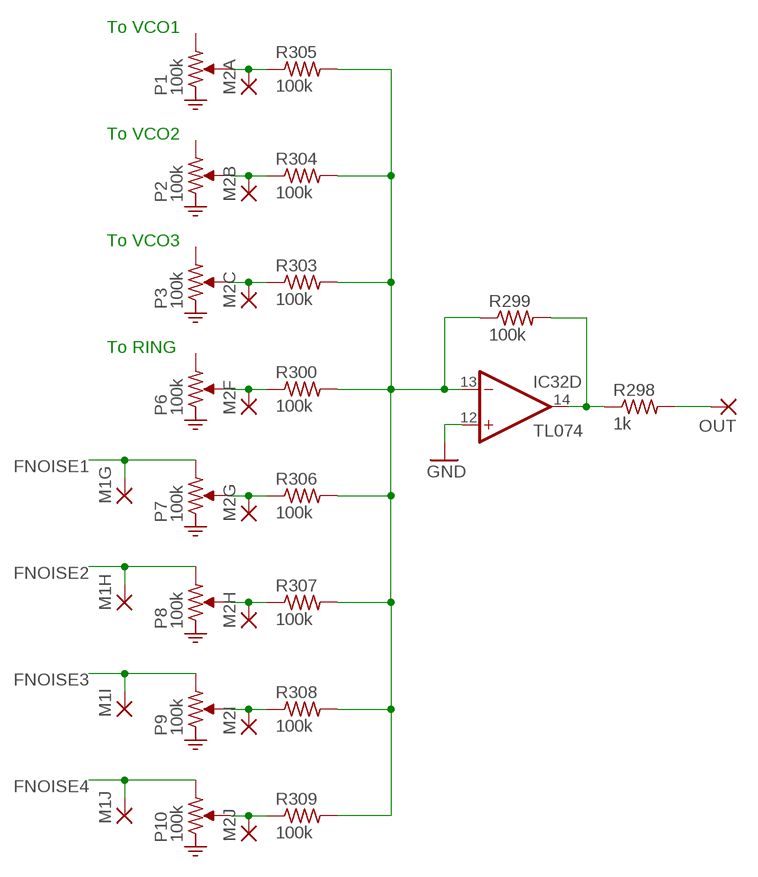
[diagram p5: schematic, sheet 6]

### Parts
M1G  2,54/1,0  [2,54/1,0]
M1H  2,54/1,0  [2,54/1,0]
M1I  2,54/1,0  [2,54/1,0]
M1J  2,54/1,0  [2,54/1,0]
M2A  2,54/1,0  [2,54/1,0]
M2B  2,54/1,0  [2,54/1,0]
M2C  2,54/1,0  [2,54/1,0]
M2F  2,54/1,0  [2,54/1,0]
M2G  2,54/1,0  [2,54/1,0]
M2H  2,54/1,0  [2,54/1,0]
M2I  2,54/1,0  [2,54/1,0]
M2J  2,54/1,0  [2,54/1,0]
OUT  2,54/1,0  [2,54/1,0]
P1  100k  POT-ATTEN  (no package)
P2  100k  POT-ATTEN  (no package)
P3  100k  POT-ATTEN  (no package)
P6  100k  POT-ATTEN  (no package)
P7  100k  POT-ATTEN  (no package)
P8  100k  POT-ATTEN  (no package)
P9  100k  POT-ATTEN  (no package)
P10  100k  POT-ATTEN  (no package)
R298  1k  R-US_0207/10  [0207/10]
R299  100k  R-US_0207/10  [0207/10]
R300  100k  R-US_0207/10  [0207/10]
R303  100k  R-US_0207/10  [0207/10]
R304  100k  R-US_0207/10  [0207/10]
R305  100k  R-US_0207/10  [0207/10]
R306  100k  R-US_0207/10  [0207/10]
R307  100k  R-US_0207/10  [0207/10]
R308  100k  R-US_0207/10  [0207/10]
R309  100k  R-US_0207/10  [0207/10]

### Nets
FNOISE1: M1G.1(P) P7.1 ; also sheet 2
FNOISE2: M1H.1(P) P8.1 ; also sheet 3
FNOISE3: M1I.1(P) P9.1 ; also sheet 4
FNOISE4: M1J.1(P) P10.1 ; also sheet 5
GND: IC32.12(D:+IN) ; also sheet 1,2,3,4,5
N$358: IC32.13(D:-IN) R299.1 R300.2 R303.2 R304.2 R305.2 R306.2 R307.2 R308.2 R309.2
N$359: IC32.14(D:OUT) R298.1 R299.2
N$360: OUT.1(P) R298.2
N$361: M2A.1(P) P1.2 R305.1
N$362: M2B.1(P) P2.2 R304.1
N$363: M2C.1(P) P3.2 R303.1
N$366: M2F.1(P) P6.2 R300.1
N$367: M2G.1(P) P7.2 R306.1
N$368: M2H.1(P) P8.2 R307.1
N$369: M2I.1(P) P9.2 R308.1
N$370: M2J.1(P) P10.2 R309.1
Unconnected: P1.1 P2.1 P3.1 P6.1

### Notes on the sheet
- To VCO1
- To VCO2
- To VCO3
- To RING

## Library data of the parts
+12V -12V BP1-BP4 CF1A CF1B CF1C CF1D CF2A CF2B CF2C CF2D CF3A CF3B CF3C CF3D CVFA2 CVFB2 CVFC2 CVFD2 DCYF2A DCYF2B DCYF2C DCYF2D F1C F1Q1-F1Q3 F2C F2Q1-F2Q3 F3C F4C F4Q1-F4Q3 GND GNDP HP1-HP4 LP1-LP4 M1G M1H M1I M1J M2A M2B M2C M2F M2G M2H M2I M2J N1-N4 OUT SWPF1A SWPF1B SWPF1C SWPF1D SWPF2A SWPF2B SWPF2C SWPF2D TRGF1-TRGF4 = wirepad:2,54/1,0: THROUGH-HOLE PAD
C8 C67-C70 C73-C79 C81-C91 C93-C103 C105-C114 = rcl:C-US: CAPACITOR, American symbol
C9 C71 C72 C80 C92 C104 = rcl:CPOL-US: POLARIZED CAPACITOR, American symbol
CFA CFB CFC CFD QA QB QC QD = mmoretti:POT
CVFA CVFB CVFC CVFD P1-P3 P6-P10 SWPF1-SWPF4 = mmoretti:POT-ATTEN
D2 D36-D38 = diode:1N4148: DIODE high speed (Philips)
DCYF1-DCYF4 = mmoretti:POT-RHEO
F3Q1-F3Q3 = wirepad:2,54/1,1: THROUGH-HOLE PAD
IC3 IC23-IC25 IC27 IC28 IC30 IC31 = mmoretti:LM13700: Dual OTA with buffers
IC22 IC26 IC29 IC32 = mmoretti:TL074-TOP: OP AMP
Q1-Q8 = mmoretti:2N5457
R18 R24-R29 R179-R188 R191-R300 R303-R309 = rcl:R-US_: RESISTOR, American symbol
S1-S4 = mmoretti:SP3T
T5 T29 T34 T36 T39 T41 T44 T46 = transistor-neu-to92:*-NPN-: NPN Transistror
T6 T30 T31 T35 T37 T38 T40 T42 T43 T45 T47 T48 = transistor-neu-to92:*-PNP-: PNP Transistror
U$1 = mmoretti:EURORACK-POWER

## Board
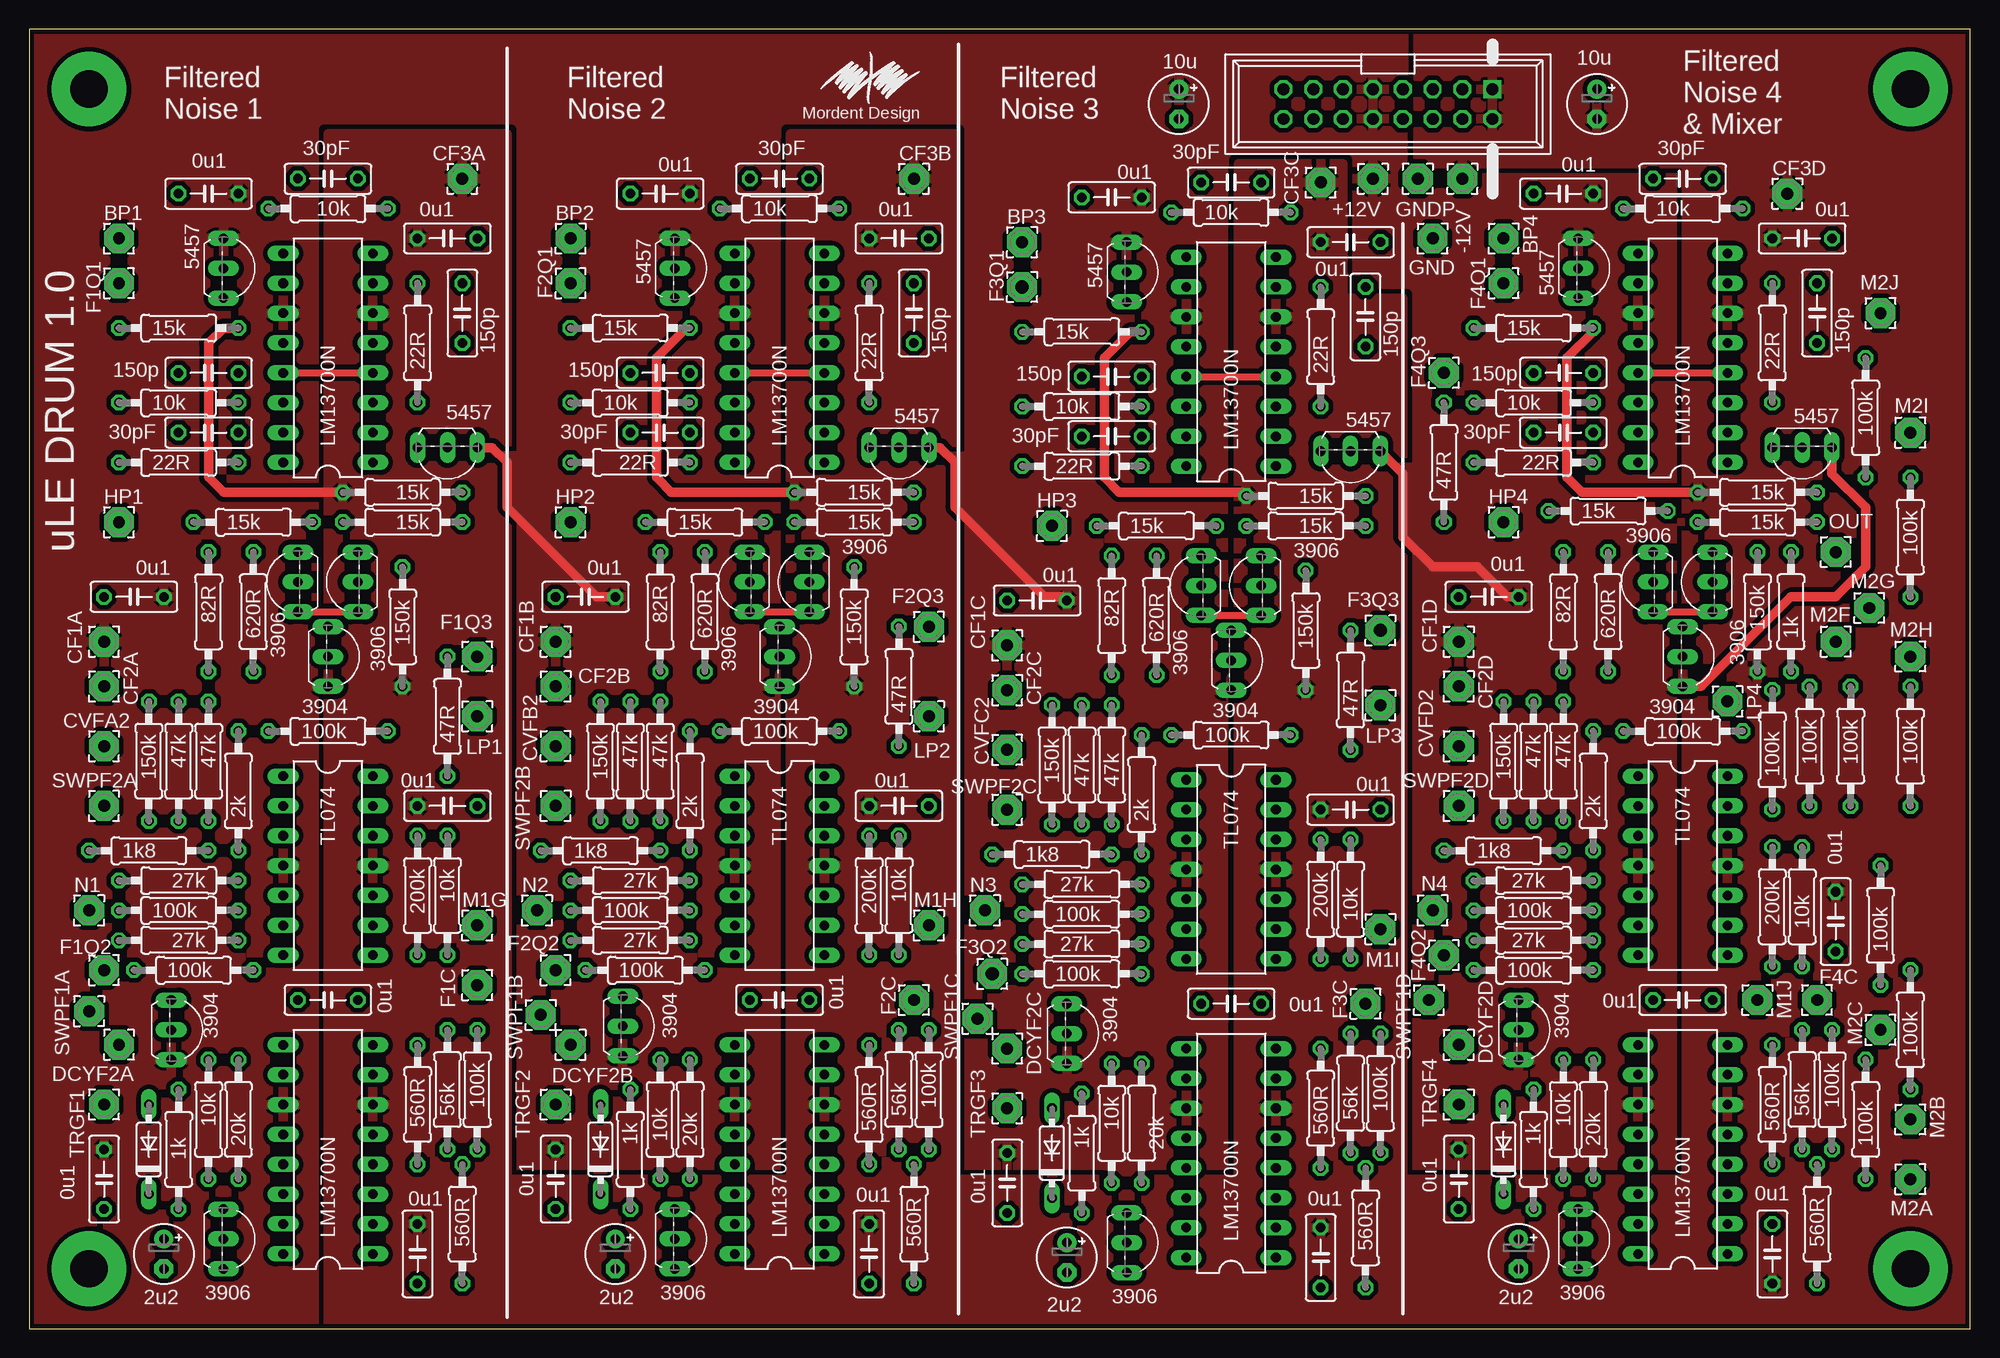
[diagram p6: board, top side]
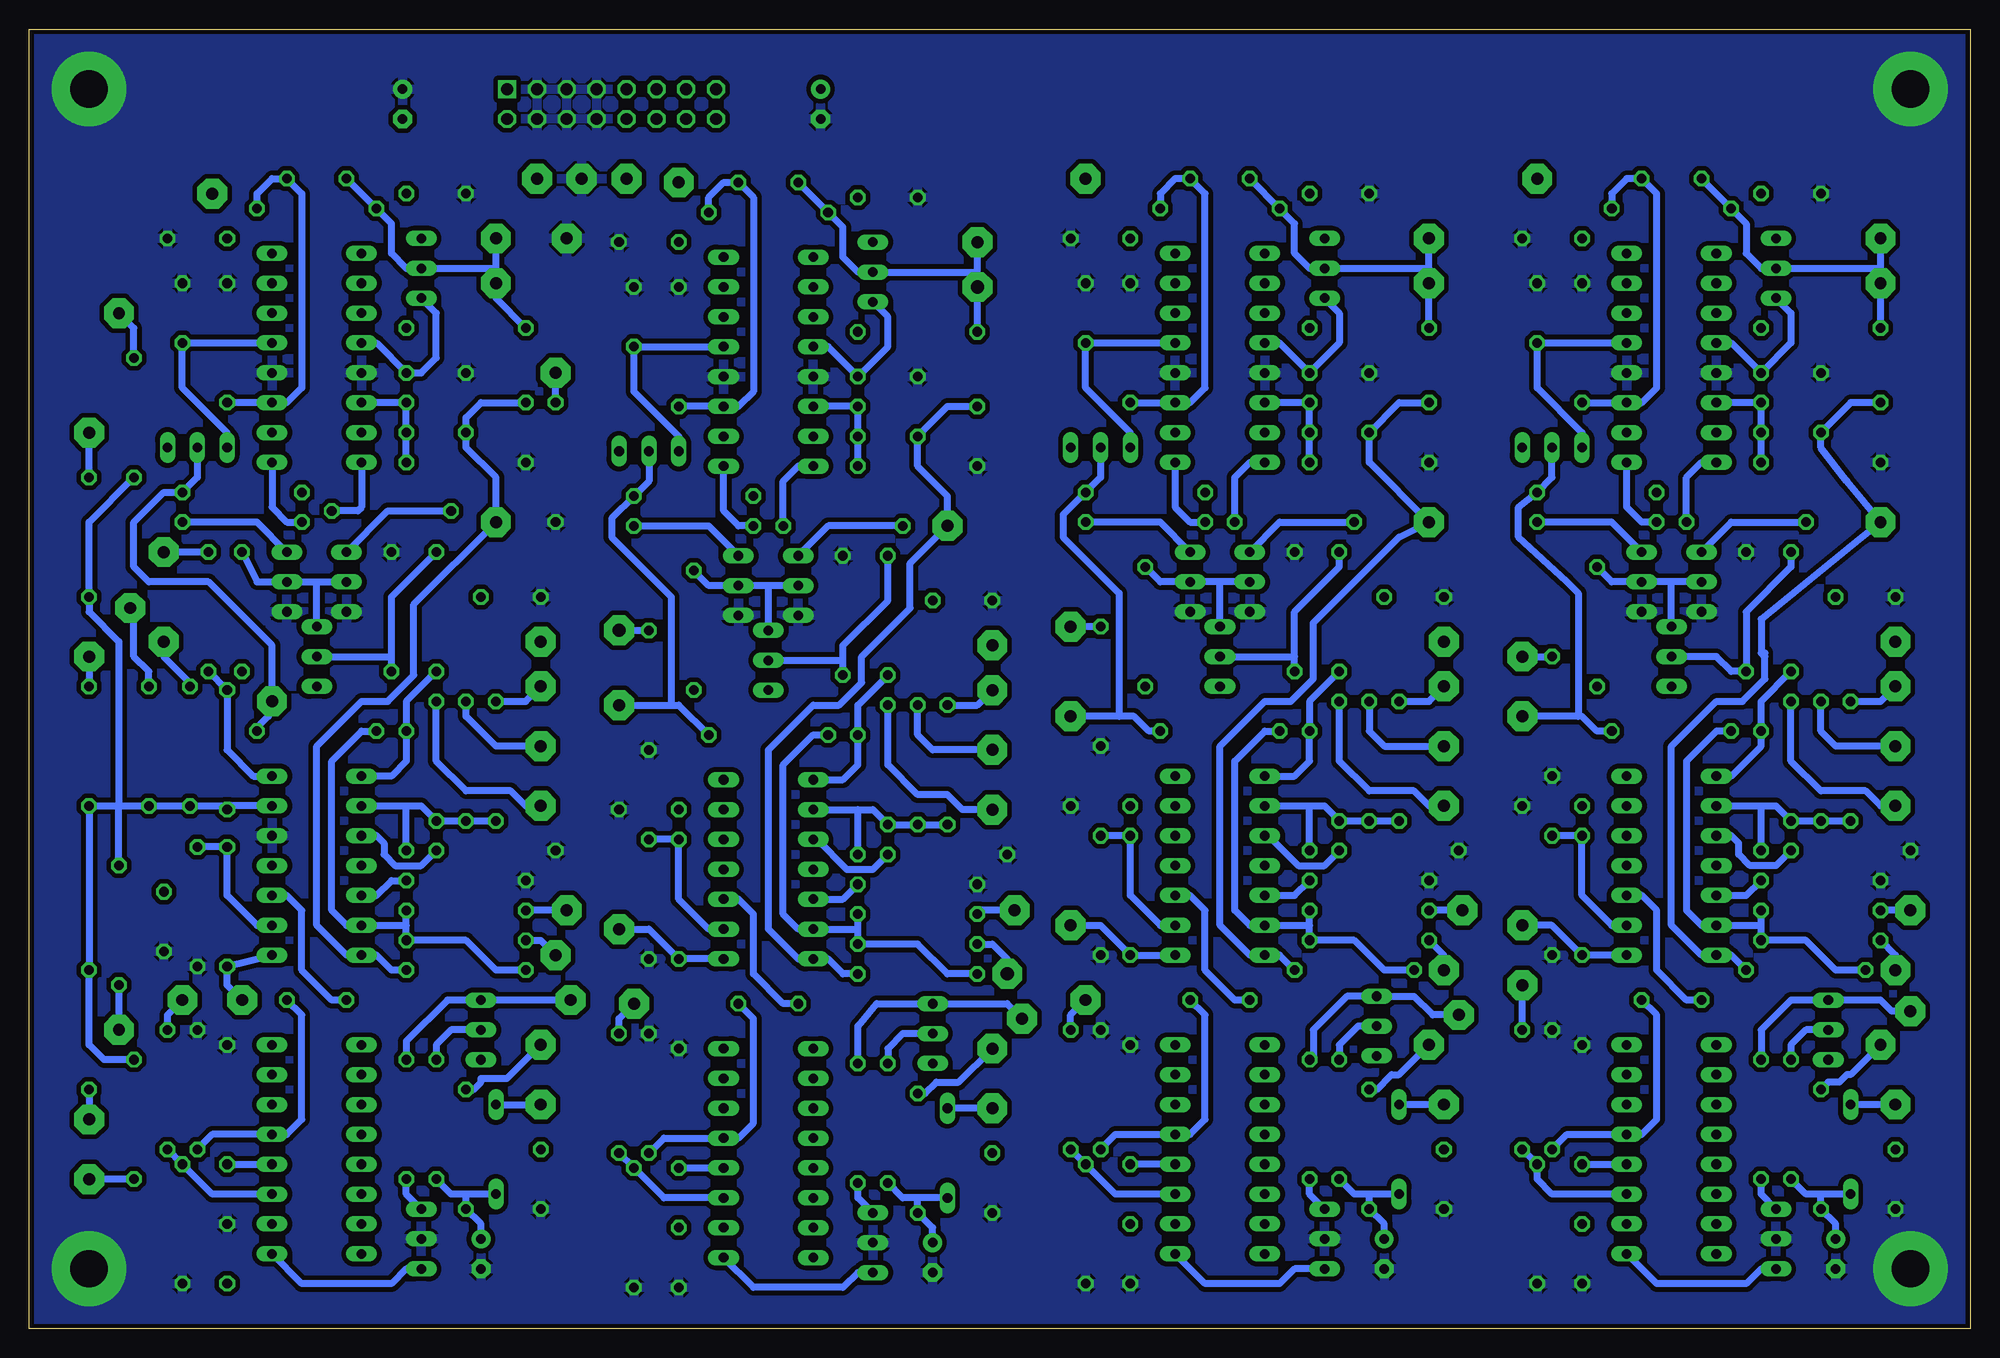
[diagram p7: board, bottom side, seen from below]

Size 165.1 x 110.49 mm. Coordinates in mm from the lower left corner, seen from the top.
Outline: 0,0 165.1,0 165.1,110.49 0,110.49 0,0
Copper layers (1*16): Top 0.035mm / dielectric 1.5mm / Bottom 0.035mm
Design rules "SeeedStudio_2layer_DRU_no_angle_20140221": minimum track width 6mil, minimum drill 12mil, track to track 6mil, track to pad 6mil, pad to pad 6mil, via to via 6mil, smd to smd 0mil, copper to edge 10mil, drill to drill 10mil, minimum pad ring 10mil, minimum via ring 6mil, stop-mask expansion 2mil, vias tented up to drill 100mil, thermal gap 10mil

### Footprints (pad centres in the part's own frame; a part is rotated, then mirrored left to right if it is on the bottom)
2,54/1,0 = drill 1.016 pad 2.54 octagon: 1 0,0
C050-025X075 = drill 0.813 octagon: 1 -2.54,0; 2 2.54,0
E2,5-5 = drill 0.813 pad 1.6: + -1.27,0 | drill 0.813 pad 1.6 octagon: - 1.27,0
DO35-7 = drill 0.813 long: A 3.81,0; C -3.81,0
2,54/1,1 = drill 1.118 pad 2.54 octagon: 1 0,0
DIL16 = drill 0.813 long: 1 -8.89,-3.81; 2 -6.35,-3.81; 3 -3.81,-3.81; 4 -1.27,-3.81; 5 1.27,-3.81; 6 3.81,-3.81; 7 6.35,-3.81; 8 8.89,-3.81; 9 8.89,3.81; 10 6.35,3.81; 11 3.81,3.81; 12 1.27,3.81; 13 -1.27,3.81; 14 -3.81,3.81; 15 -6.35,3.81; 16 -8.89,3.81
DIL14 = drill 0.813 long: 1 -7.62,-3.81; 2 -5.08,-3.81; 3 -2.54,-3.81; 4 0,-3.81; 5 2.54,-3.81; 6 5.08,-3.81; 7 7.62,-3.81; 8 7.62,3.81; 9 5.08,3.81; 10 2.54,3.81; 11 0,3.81; 12 -2.54,3.81; 13 -5.08,3.81; 14 -7.62,3.81
TO92-EBC = drill 0.813 long: B 0,-1.27; C 2.54,-1.27; E -2.54,-1.27
0207/10 = drill 0.813 octagon: 1 -5.08,0; 2 5.08,0
PINSHRD_PTH_2X8 = drill 1.016 octagon: +5V@1 3.81,1.27; +5V@2 3.81,-1.27; +12V@1 1.27,1.27; +12V@2 1.27,-1.27; -12V@1 -8.89,1.27; CV@1 6.35,1.27; CV@2 6.35,-1.27; GATE@1 8.89,1.27; GATE@2 8.89,-1.27; GND@1 -6.35,1.27; GND@2 -6.35,-1.27; GND@3 -3.81,1.27; GND@4 -3.81,-1.27; GND@5 -1.27,1.27; GND@6 -1.27,-1.27 | drill 1.016 square: -12V@2 -8.89,-1.27

### Placement (x,y rotation side)
+12V  114.3,97.79 0 top
-12V  121.92,97.79 0 top
BP1  7.62,92.71 0 top
BP2  46.04,92.71 0 top
BP3  84.45,92.39 0 top
BP4  125.41,92.71 0 top
C8  25.4,27.94 180 top
C9  11.43,6.35 270 top
C67  15.24,76.2 0 top
C68  15.24,81.28 180 top
C69  25.4,97.79 0 top
C70  36.83,86.36 90 top
C71  97.79,104.14 270 top
C72  133.35,104.14 270 top
C73  6.35,12.7 270 top
C74  33.02,6.35 90 top
C75  8.89,62.23 180 top
C76  35.56,44.45 180 top
C77  15.24,96.52 180 top
C78  35.56,92.71 180 top
C79  63.82,27.94 180 top
C80  49.85,6.35 270 top
C81  53.66,76.2 0 top
C82  53.66,81.28 180 top
C83  63.82,97.79 0 top
C84  75.25,86.36 90 top
C85  53.66,96.52 180 top
C86  73.98,92.71 180 top
C87  47.31,62.23 180 top
C88  73.98,44.45 180 top
C89  44.77,12.7 270 top
C90  71.44,6.35 90 top
C91  102.23,27.62 180 top
C92  88.27,6.03 270 top
C93  92.08,75.88 0 top
C94  92.08,80.96 180 top
C95  102.23,97.47 0 top
C96  113.67,86.04 90 top
C97  85.72,61.91 180 top
C98  112.39,44.13 180 top
C99  83.19,12.38 270 top
C100  112.39,92.39 180 top
C101  92.08,96.2 180 top
C102  109.86,6.03 90 top
C103  140.65,27.94 180 top
C104  126.68,6.35 270 top
C105  130.49,76.2 0 top
C106  130.49,81.28 180 top
C107  140.65,97.79 0 top
C108  152.08,86.36 90 top
C109  121.6,12.7 270 top
C110  150.81,92.71 180 top
C111  124.14,62.23 180 top
C112  153.67,34.61 90 top
C113  130.49,96.52 180 top
C114  148.27,6.35 270 top
CF1A  6.35,58.42 0 top
CF1B  44.77,58.42 0 top
CF1C  83.19,58.1 0 top
CF1D  121.6,58.42 0 top
CF2A  6.35,54.61 0 top
CF2B  44.77,54.61 0 top
CF2C  83.19,54.29 0 top
CF2D  121.6,54.61 0 top
CF3A  36.83,97.79 0 top
CF3B  75.25,97.79 0 top
CF3C  109.86,97.47 0 top
CF3D  149.54,96.52 0 top
CVFA2  6.35,49.53 0 top
CVFB2  44.77,49.53 90 top
CVFC2  83.19,49.21 90 top
CVFD2  121.6,49.53 90 top
D2  10.16,15.24 90 top
D36  48.58,15.24 90 top
D37  87,14.92 90 top
D38  125.41,15.24 90 top
DCYF2A  7.62,24.13 180 top
DCYF2B  46.04,24.13 0 top
DCYF2C  83.19,23.81 0 top
DCYF2D  121.6,24.13 0 top
F1C  38.1,29.21 90 top
F1Q1  7.62,88.9 90 top
F1Q2  6.35,30.48 90 top
F1Q3  38.1,57.15 90 top
F2C  75.25,27.94 90 top
F2Q1  46.04,88.9 90 top
F2Q2  44.77,30.48 90 top
F2Q3  76.52,59.69 90 top
F3C  113.67,27.62 90 top
F3Q1  84.45,88.58 90 top
F3Q2  81.92,30.16 90 top
F3Q3  114.94,59.37 90 top
F4C  152.08,27.94 90 top
F4Q1  125.41,88.9 90 top
F4Q2  120.33,31.75 90 top
F4Q3  120.33,81.28 90 top
GND  118.11,97.79 180 top
GNDP  119.38,92.71 0 top
HP1  7.62,68.58 0 top
HP2  46.04,68.58 0 top
HP3  87,68.26 0 top
HP4  125.41,68.58 0 top
IC3  25.4,15.24 90 top
IC22  25.4,39.37 270 top
IC23  25.4,82.55 90 top
IC24  63.82,15.24 90 top
IC25  63.82,82.55 90 top
IC26  63.82,39.37 270 top
IC27  102.23,14.92 90 top
IC28  102.23,82.23 90 top
IC29  102.23,39.05 270 top
IC30  140.65,15.24 90 top
IC31  140.65,82.55 90 top
IC32  140.65,39.37 270 top
LP1  38.1,52.07 0 top
LP2  76.52,52.07 0 top
LP3  114.94,53.02 0 top
LP4  144.46,53.34 0 top
M1G  38.1,34.29 0 top
M1H  76.52,34.29 0 top
M1I  114.94,33.97 0 top
M1J  147,27.94 0 top
M2A  160.02,12.7 90 top
M2B  160.02,17.78 90 top
M2C  157.48,25.4 90 top
M2F  153.67,58.42 90 top
M2G  156.53,61.28 90 top
M2H  160.02,57.15 90 top
M2I  160.02,76.2 90 top
M2J  157.48,86.36 90 top
N1  5.08,35.56 0 top
N2  43.18,35.56 0 top
N3  81.28,35.56 0 top
N4  119.38,35.56 0 top
OUT  153.67,66.04 90 top
Q1  17.78,90.17 270 top
Q2  35.56,73.66 180 top
Q3  56.2,90.17 270 top
Q4  73.98,73.66 180 top
Q5  94.61,89.85 270 top
Q6  112.39,73.34 180 top
Q7  133.03,90.17 270 top
Q8  150.81,73.66 180 top
R18  12.7,15.24 270 top
R24  15.24,17.78 270 top
R25  17.78,17.78 90 top
R26  36.83,8.89 270 top
R27  33.02,19.05 90 top
R28  38.1,20.32 270 top
R29  35.56,20.32 90 top
R179  12.7,48.26 270 top
R180  10.16,48.26 270 top
R181  19.05,68.58 0 top
R182  15.24,48.26 270 top
R183  17.78,45.72 90 top
R184  10.16,40.64 0 top
R185  15.24,60.96 270 top
R186  19.05,60.96 90 top
R187  31.75,59.69 270 top
R188  31.75,68.58 180 top
R191  12.7,35.56 0 top
R192  12.7,38.1 180 top
R193  13.97,30.48 0 top
R194  12.7,78.74 0 top
R195  12.7,73.66 180 top
R196  12.7,85.09 0 top
R197  25.4,95.25 0 top
R198  33.02,83.82 90 top
R199  31.75,71.12 180 top
R200  12.7,33.02 180 top
R201  35.56,52.07 90 top
R202  25.4,50.8 0 top
R203  35.56,36.83 270 top
R204  33.02,36.83 270 top
R205  51.12,15.24 270 top
R206  53.66,17.78 270 top
R207  56.2,17.78 90 top
R208  75.25,8.89 270 top
R209  71.44,19.05 90 top
R210  76.52,20.32 270 top
R211  73.98,20.32 90 top
R212  51.12,48.26 270 top
R213  48.58,48.26 270 top
R214  53.66,48.26 270 top
R215  56.2,45.72 90 top
R216  48.58,40.64 0 top
R217  53.66,60.96 270 top
R218  57.47,60.96 90 top
R219  70.17,59.69 270 top
R220  57.47,68.58 0 top
R221  70.17,68.58 180 top
R222  51.12,35.56 0 top
R223  51.12,38.1 180 top
R224  52.39,30.48 0 top
R225  51.12,78.74 0 top
R226  51.12,73.66 180 top
R227  51.12,85.09 0 top
R228  63.82,95.25 0 top
R229  71.44,83.82 90 top
R230  70.17,71.12 180 top
R231  51.12,33.02 180 top
R232  73.98,54.61 90 top
R233  63.82,50.8 0 top
R234  73.98,36.83 270 top
R235  71.44,36.83 270 top
R236  89.53,14.92 270 top
R237  92.08,17.46 270 top
R238  94.61,17.46 90 top
R239  113.67,8.57 270 top
R240  109.86,18.73 90 top
R241  114.94,20 270 top
R242  112.39,20 90 top
R243  89.53,47.94 270 top
R244  87,47.94 270 top
R245  92.08,47.94 270 top
R246  94.61,45.4 90 top
R247  87,40.32 0 top
R248  92.08,60.64 270 top
R249  95.89,60.64 90 top
R250  108.58,59.37 270 top
R251  95.89,68.26 0 top
R252  108.58,68.26 180 top
R253  89.53,35.24 0 top
R254  89.53,37.78 180 top
R255  89.53,30.16 0 top
R256  89.53,78.42 0 top
R257  89.53,73.34 180 top
R258  89.53,84.77 0 top
R259  102.23,94.93 0 top
R260  109.86,83.5 90 top
R261  108.58,70.8 180 top
R262  89.53,32.7 180 top
R263  112.39,54.29 90 top
R264  102.23,50.48 0 top
R265  112.39,36.51 270 top
R266  109.86,36.51 270 top
R267  127.95,15.24 270 top
R268  130.49,17.78 270 top
R269  133.03,17.78 90 top
R270  152.08,8.89 270 top
R271  148.27,19.05 90 top
R272  153.35,20.32 270 top
R273  150.81,20.32 90 top
R274  127.95,48.26 270 top
R275  125.41,48.26 270 top
R276  130.49,48.26 270 top
R277  133.03,45.72 90 top
R278  125.41,40.64 0 top
R279  130.49,60.96 270 top
R280  134.3,60.96 90 top
R281  147,60.96 270 top
R282  134.3,69.53 0 top
R283  147,68.58 180 top
R284  127.95,35.56 0 top
R285  127.95,38.1 180 top
R286  127.95,30.48 0 top
R287  127.95,78.74 0 top
R288  127.95,73.66 180 top
R289  127.95,85.09 0 top
R290  140.65,95.25 0 top
R291  148.27,83.82 90 top
R292  147,71.12 180 top
R293  127.95,33.02 180 top
R294  120.33,73.66 90 top
R295  140.65,50.8 0 top
R296  150.81,35.88 270 top
R297  148.27,35.88 270 top
R298  149.86,60.96 90 top
R299  148.27,49.21 90 top
R300  151.45,49.53 270 top
R303  157.48,34.29 90 top
R304  160.02,25.4 90 top
R305  156.21,17.78 90 top
R306  154.94,49.53 270 top
R307  160.02,49.53 270 top
R308  160.02,67.31 270 top
R309  156.21,77.47 270 top
SWPF1A  5.08,26.99 180 top
SWPF1B  43.5,26.67 0 top
SWPF1C  80.64,26.35 0 top
SWPF1D  119.06,27.94 0 top
SWPF2A  6.35,44.45 0 top
SWPF2B  44.77,44.45 0 top
SWPF2C  83.19,44.13 0 top
SWPF2D  121.6,44.45 0 top
T5  13.34,25.4 270 top
T6  17.78,7.62 270 top
T29  26.67,57.15 270 top
T30  21.59,63.5 90 top
T31  26.67,63.5 90 top
T34  51.75,25.72 270 top
T35  56.2,7.62 270 top
T36  65.09,57.15 270 top
T37  60.01,63.5 90 top
T38  65.09,63.5 90 top
T39  89.53,25.08 270 top
T40  94.61,7.3 270 top
T41  103.5,56.83 270 top
T42  98.42,63.18 90 top
T43  103.5,63.18 90 top
T44  127.95,25.4 270 top
T45  133.03,7.62 270 top
T46  141.92,57.15 270 top
T47  136.84,63.5 90 top
T48  141.92,63.5 90 top
TRGF1  6.35,19.05 180 top
TRGF2  44.77,19.05 0 top
TRGF3  83.19,18.73 0 top
TRGF4  121.6,19.05 0 top
U$1  115.57,104.14 180 top

### Tracks (layer width: path | path; a pad name or v marks a point on that pad's centre or on a via)
+12V
  Top 0.813: C87.1 48.26,62.23 40.64,69.85 40.64,73.66 39.37,74.93 Q2.E | C111.1 125.73,62.23 123.19,64.77 119.38,64.77 116.84,67.31 116.84,72.71 Q6.E | Q8.E 153.35,72.71 156.21,69.85 156.21,64.77 153.67,62.23 149.86,62.23 142.24,54.61 T46.C | Q4.E 77.47,74.93 78.74,73.66 78.74,69.85 86.36,62.23 87.95,62.23 C97.1
  pour Top (isolate 0.406, rank 2): 0,110.49 25.4,110.49 25.4,0 0,0
  pour Top (isolate 0.406, rank 2): 25.4,110.49 63.5,110.49 63.5,12.7 40.64,12.7 40.64,101.6 25.4,101.6
  pour Top (isolate 0.406, rank 2): 111.76,102.87 111.76,87.63 116.84,87.63 116.84,12.7 140.97,12.7 140.97,99.06 116.84,99.06 116.84,104.14 111.76,104.14
  pour Top (isolate 0.406, rank 2): 63.5,110.49 140.97,110.49 140.97,104.14 116.84,104.14 116.84,99.06 80.01,99.06 80.01,101.6 63.5,101.6
  pour Top (isolate 0.406, rank 2): 78.74,101.6 78.74,12.7 101.6,12.7 101.6,99.06 80.01,99.06 80.01,101.6
-12V
  Top 0.813: R196.2 16.51,85.09 15.24,83.82 15.24,72.39 16.51,71.12 R199.2 | R258.2 93.66,84.77 91.44,82.55 91.44,72.39 92.71,71.12 103.19,71.12 R261.2 | R289.2 133.03,84.77 130.81,82.55 130.81,72.39 132.08,71.12 R292.2 | R227.2 55.88,85.09 53.34,82.55 53.34,72.39 54.61,71.12 R230.2
  pour Top (isolate 0.406): 25.4,0 40.64,0 40.64,101.6 25.4,101.6
  pour Top (isolate 0.406): 40.64,0 140.97,0 140.97,12.7 40.64,12.7
  pour Top (isolate 0.406): 78.74,12.7 64.77,12.7 64.77,101.6 78.74,101.6
  pour Top (isolate 0.406): 102.87,12.7 102.87,99.06 111.76,99.06 111.76,87.63 116.84,87.63 116.84,12.7
  pour Top (isolate 0.406): 140.97,0 165.1,0 165.1,110.49 118.11,110.49 118.11,99.06 140.97,99.06
FNOISE1
  Bottom 0.61: IC22.8 R204.2 35.56,34.29 M1G.1
FNOISE2
  Bottom 0.61: M1H.1 73.98,34.29 R235.2 IC26.8
FNOISE3
  Bottom 0.61: IC29.8 R266.2 112.39,33.97 M1I.1
FNOISE4
  Bottom 0.61: M1J.1 148.27,29.21 R297.2 IC32.8
GND  (via drill 3.17 pad 6.35)
  Top 0.61: T30.E T31.E | T37.E T38.E | T42.E T43.E | IC28.13 IC28.4 | IC31.13 IC31.4 | IC25.13 IC25.4 | IC23.13 IC23.4 | T47.E T48.E
  other vias: 5.08,105.41 160.02,105.41 160.02,5.08 5.08,5.08
  pour Bottom (isolate 0.406): 0,110.49 165.1,110.49 165.1,0 0,0
N1
  Bottom 0.61: N1.1 R191.1
N2
  Bottom 0.61: N2.1 R222.1
N3
  Bottom 0.61: N3.1 84.14,35.56 R253.1
N4
  Bottom 0.61: N4.1 R284.1
N$29
  Bottom 0.61: D2.C 12.7,11.43 | 12.7,11.43 13.97,11.43 R24.2 | 12.7,11.43 R18.2 11.43,8.89 C9.+
N$30
  Bottom 0.61: T5.B 13.97,25.4 15.24,24.13 R24.1
N$31
  Bottom 0.61: SWPF1A.1 6.67,26.99 7.62,27.94 T5.E 15.24,27.94 17.78,25.4 R25.2
N$32
  Bottom 0.61: T6.E 17.78,11.43 R25.1
N$33
  Bottom 0.61: R28.1 F1C.1
N$34
  Bottom 0.61: IC3.3 35.56,11.43 36.83,12.7 R26.1 R28.2
N$35
  Bottom 0.61: R27.1 IC3.4
N$36
  Bottom 0.61: R29.1 34.29,16.51 IC3.5 27.94,16.51 26.67,17.78 26.67,26.67 C8.1
N$37
  Bottom 0.61: TRGF1.1 D2.A
N$38
  Bottom 0.61: DCYF2A.1 10.16,21.59 10.48,21.59 11.11,20.95 12.06,20.95 R18.1
N$39
  Bottom 0.61: SWPF2A.1 7.62,44.45 8.89,45.72 12.7,45.72 15.24,48.26 R182.1
N$105
  Bottom 0.61: CVFA2.1 11.43,49.53 12.7,50.8 R179.1
N$106
  Bottom 0.61: R212.1 51.12,50.8 49.85,49.53 CVFB2.1
N$107
  Bottom 0.61: CVFC2.1 88.27,49.21 89.53,50.48 R243.1
N$108
  Bottom 0.61: CVFD2.1 125.41,49.53 127.95,52.07 R274.1
N$223
  Bottom 0.61: R180.1 7.62,53.34 CF2A.1
N$224
  Bottom 0.61: IC22.2 17.78,44.45 | 17.78,44.45 16.51,44.45 R182.2 R179.2 R180.2 | R183.1 17.78,44.45
N$225
  Bottom 0.61: C8.2 24.13,27.94 26.67,30.48 26.67,35.56 27.94,36.83 IC22.10
N$226
  Bottom 0.61: IC22.1 20.32,46.99 17.78,49.53 R183.2 17.78,53.34 R185.2
N$227
  Bottom 0.61: R184.2 16.51,39.37 18.73,39.37 19.68,40.32 19.68,41.27 20.32,41.91 IC22.3
N$230
  Bottom 0.61: T29.B 21.59,57.15 20.32,55.88 R186.1 19.05,60.96 15.24,64.77 R185.1
N$231
  Bottom 0.61: T30.B 25.4,63.5 | 25.4,63.5 T31.B 30.48,63.5 R187.1 | T29.E 25.4,63.5
N$232
  Bottom 0.61: T30.C 20.32,68.58 R181.1
N$233
  Bottom 0.61: T31.C 30.48,68.58 R188.1
N$235
  Bottom 0.61: R193.1 11.43,30.48 13.97,33.02 R200.1 17.78,34.29 | 17.78,34.29 R191.2 | 17.78,34.29 IC22.6 22.86,34.29 24.13,35.56 24.13,48.26 21.59,50.8 R202.1
N$236
  Bottom 0.61: IC22.5 19.05,36.83 R192.1
N$237
  Bottom 0.61: T6.C 17.78,5.08 19.05,3.81 26.67,3.81 IC3.1
N$238
  Bottom 0.61: R195.1 C67.2 R194.2 IC23.14
N$239
  Bottom 0.61: Q1.C 15.24,86.36 15.24,83.82 C68.1 20.32,83.82 IC23.12
N$240
  Bottom 0.61: Q2.C 33.02,76.2 36.83,80.01 C70.1 IC23.5
N$241
  Bottom 0.61: R181.2 24.13,72.39 22.86,73.66 IC23.16
N$242
  Bottom 0.61: IC22.9 30.48,34.29 33.02,36.83 R204.1 R203.1
N$243
  Bottom 0.61: R198.1 IC23.3 27.94,78.74 26.67,80.01 26.67,96.52 C69.2 29.21,97.79 30.48,96.52 R197.2
N$244
  Bottom 0.61: D37.C 89.53,11.11 | 89.53,11.11 90.81,11.11 R237.2 | 89.53,11.11 R236.2 88.27,8.57 C92.+
N$245
  Bottom 0.61: R188.2 27.94,68.58 29.21,69.85 IC23.1
N$246
  Bottom 0.61: F1Q2.1 6.35,31.75 R200.2
N$247
  Bottom 0.61: F1Q3.1 R201.2
N$248
  Bottom 0.61: R193.2 20.32,31.75 IC22.7 22.86,31.75 25.4,34.29 25.4,49.53 21.59,53.34 19.37,53.34 17.46,55.24 17.46,57.15 | 17.46,57.15 17.46,57.47 | 17.46,57.15 17.78,57.47 17.78,60.33 9.21,67.31 HP1.1 10.48,72.07 12.7,74.93 C67.1 10.16,78.74 R194.1
N$249
  Bottom 0.61: C69.1 R197.1 19.05,93.98 19.05,91.44 17.78,90.17 Q1.B 7.62,90.17 | 7.62,90.17 F1Q1.1 R196.1 | 7.62,90.17 BP1.1
N$250
  Bottom 0.61: Q2.B 35.56,72.39 R199.1 38.42,69.85 38.42,67.31 34.29,63.5 33.34,62.55 33.34,52.07 | R202.2 31.75,50.8 33.02,52.07 33.34,52.07 | 33.34,52.07 LP1.1
N$251
  Bottom 0.61: T39.B 90.81,25.08 92.08,23.81 R237.1
N$252
  Bottom 0.61: SWPF1C.1 81.92,27.62 T39.E 93.03,27.62 94.61,25.72 R238.2
N$253
  Bottom 0.61: T40.E 94.61,11.11 R238.1
N$254
  Bottom 0.61: IC27.3 111.12,11.11 R239.1 R241.2
N$255
  Bottom 0.61: D36.C 51.12,11.43 | 51.12,11.43 52.39,11.43 R206.2 | 51.12,11.43 R205.2 49.85,8.89 C80.+
N$256
  Bottom 0.61: T34.B 52.07,25.72 53.66,24.13 R206.1
N$257
  Bottom 0.61: SWPF1B.1 45.72,26.67 47.31,28.26 T34.E 53.02,28.26 55.88,25.4 55.88,23.18 R207.2
N$258
  Bottom 0.61: T35.E 56.2,11.43 R207.1
N$259
  Bottom 0.61: IC24.3 72.71,11.43 R208.1 R210.2
N$260
  Bottom 0.61: IC24.4 R209.1
N$261
  Bottom 0.61: R211.1 72.71,16.51 IC24.5 66.36,16.51 65.09,17.78 65.09,26.67 C79.1
N$262
  Bottom 0.61: TRGF2.1 D36.A
N$263
  Bottom 0.61: R205.1 50.48,20.32 49.21,21.59 48.58,21.59 DCYF2B.1
N$264
  Bottom 0.61: SWPF2B.1 46.04,44.45 47.31,45.72 51.12,45.72 53.66,48.26 R214.1
N$266
  Bottom 0.61: IC26.2 56.2,44.45 | 56.2,44.45 54.93,44.45 R214.2 R212.2 R213.2 | R215.1 56.2,44.45
N$267
  Bottom 0.61: R217.2 56.2,53.34 R215.2 56.2,48.26 57.47,46.99 IC26.1
N$268
  Bottom 0.61: IC26.3 59.69,41.91 57.15,39.37 54.93,39.37 R216.2
N$269
  Bottom 0.61: R218.1 57.47,57.15 | 57.47,57.15 57.47,60.96 53.66,64.77 R217.1 | T36.B 57.47,57.15
N$270
  Bottom 0.61: T37.B 63.82,63.5 | 63.82,63.5 T38.B 68.9,63.5 R219.1 | T36.E 63.82,63.5
N$271
  Bottom 0.61: T37.C 58.74,68.58 R220.1
N$272
  Bottom 0.61: T38.C 68.9,68.58 R221.1
N$273
  Bottom 0.61: R213.1 46.04,53.34 CF2B.1
N$274
  Bottom 0.61: R224.1 49.85,30.48 52.39,33.02 R231.1 56.2,34.29 | 56.2,34.29 R222.2 | 56.2,34.29 IC26.6 61.28,34.29 62.55,35.56 62.55,48.26 60.01,50.8 R233.1
N$275
  Bottom 0.61: IC26.5 57.47,36.83 R223.1
N$276
  Bottom 0.61: R226.1 C81.2 R225.2 IC25.14
N$277
  Bottom 0.61: Q3.C 53.66,86.36 53.66,83.82 C82.1 58.74,83.82 IC25.12
N$278
  Bottom 0.61: R220.2 62.55,72.39 61.28,73.66 IC25.16
N$279
  Bottom 0.61: R229.1 IC25.3 66.36,78.74 65.09,80.01 65.09,96.52 C83.2 67.63,97.79 68.9,96.52 R228.2
N$280
  Bottom 0.61: Q4.C 71.44,76.2 75.25,80.01 C84.1 IC25.5
N$281
  Bottom 0.61: IC25.1 67.63,69.85 66.36,68.58 R221.2
N$282
  Bottom 0.61: R231.2 44.77,31.75 F2Q2.1
N$283
  Bottom 0.61: R232.2 F2Q3.1
N$284
  Bottom 0.61: R224.2 58.74,31.75 IC26.7 61.28,31.75 63.82,34.29 63.82,49.53 60.01,53.34 57.78,53.34 55.88,55.24 55.88,60.01 48.58,67.31 HP2.1 51.12,73.66 C81.1 48.58,78.74 R225.1
N$285
  Bottom 0.61: C83.1 R228.1 57.47,93.98 57.47,91.44 56.2,90.17 Q3.B 46.04,90.17 | 46.04,90.17 F2Q1.1 R227.1 | 46.04,90.17 BP2.1
N$286
  Bottom 0.61: Q4.B 73.98,72.39 R230.1 77.15,69.22 77.15,67.31 72.39,62.55 72.39,52.07 | R233.2 69.85,50.8 71.12,52.07 72.39,52.07 | 72.39,52.07 LP2.1
N$287
  Bottom 0.61: R210.1 76.52,26.67 F2C.1
N$288
  Bottom 0.61: T35.C 57.47,5.08 58.74,3.81 65.09,3.81 IC24.1
N$289
  Bottom 0.61: C79.2 62.55,27.94 65.09,30.48 65.09,35.56 66.36,36.83 IC26.10
N$290
  Bottom 0.61: IC26.9 68.9,34.29 71.44,36.83 R235.1 R234.1
N$291
  Bottom 0.61: R240.1 IC27.4
N$292
  Bottom 0.61: R242.1 111.12,16.19 IC27.5 104.78,16.19 103.5,17.46 103.5,26.35 C91.1
N$293
  Bottom 0.61: TRGF3.1 D37.A
N$294
  Bottom 0.61: R236.1 88.9,20 87.95,20.95 86.04,20.95 DCYF2C.1
N$295
  Bottom 0.61: SWPF2C.1 85.72,44.13 87,45.4 89.53,45.4 92.08,47.94 R245.1
N$297
  Bottom 0.61: IC29.2 94.61,44.13 | 94.61,44.13 93.34,44.13 R245.2 R243.2 R244.2 | R246.1 94.61,44.13
N$298
  Bottom 0.61: IC29.1 95.89,46.67 94.61,47.94 R246.2 94.61,53.02 R248.2
N$299
  Bottom 0.61: IC29.3 98.11,41.59 95.57,39.05 93.34,39.05 R247.2
N$300
  Bottom 0.61: R249.1 95.89,56.83 | 95.89,56.83 95.89,58.1 92.08,61.91 R248.1 | T41.B 95.89,56.83
N$301
  Bottom 0.61: T42.B 102.23,63.18 | 102.23,63.18 T43.B 107.31,63.18 R250.1 | T41.E 102.23,63.18
N$302
  Bottom 0.61: R251.1 97.16,68.26 T42.C
N$303
  Bottom 0.61: R252.1 107.31,68.26 T43.C
N$304
  Bottom 0.61: R244.1 84.45,53.02 CF2C.1
N$305
  Bottom 0.61: R255.1 87,30.16 89.53,32.7 R262.1 94.61,33.97 | 94.61,33.97 R253.2 | 94.61,33.97 IC29.6 99.69,33.97 100.97,35.24 100.97,47.94 98.42,50.48 R264.1
N$306
  Bottom 0.61: IC29.5 95.89,36.51 R254.1
N$307
  Bottom 0.61: R257.1 C93.2 R256.2 IC28.14
N$308
  Bottom 0.61: IC28.12 97.16,83.5 C94.1 92.08,83.5 92.08,86.04 Q5.C
N$309
  Bottom 0.61: R251.2 100.97,72.07 99.69,73.34 IC28.16
N$310
  Bottom 0.61: R259.2 107.31,96.2 106.05,97.47 C95.2 103.5,96.2 103.5,79.69 104.78,78.42 IC28.3 R260.1
N$311
  Bottom 0.61: Q6.C 109.86,75.88 113.67,79.69 C96.1 IC28.5
N$312
  Bottom 0.61: R252.2 104.78,68.26 106.05,69.53 IC28.1
N$313
  Bottom 0.61: R262.2 83.19,32.7 81.92,31.43 F3Q2.1
N$314
  Bottom 0.61: F3Q3.1 R263.2
N$315
  Bottom 0.61: R255.2 95.89,30.16 97.16,31.43 IC29.7 99.69,31.43 102.23,33.97 102.23,49.21 98.42,53.02 96.2,53.02 94.3,54.93 94.3,57.15 90.17,61.28 90.17,65.09 HP3.1 87,70.8 89.53,73.34 C93.1 87,78.42 R256.1
N$316
  Bottom 0.61: R258.1 F3Q1.1 84.45,89.85 | 84.45,89.85 BP3.1 | 84.45,89.85 Q5.B 94.61,89.85 95.89,91.12 95.89,93.66 R259.1 C95.1
N$317
  Bottom 0.61: Q6.B 112.39,72.07 R261.1 115.57,68.9 115.57,67.31 110.49,62.23 110.49,53.02 | LP3.1 110.49,53.02 | 110.49,53.02 109.86,53.02 R264.2
N$318
  Bottom 0.61: R241.1 114.94,26.35 F3C.1
N$319
  Bottom 0.61: T40.C 94.61,4.76 95.89,3.49 103.5,3.49 IC27.1
N$320
  Bottom 0.61: C91.2 100.97,27.62 103.5,30.16 103.5,35.24 104.78,36.51 IC29.10
N$321
  Bottom 0.61: IC29.9 107.31,33.97 109.86,36.51 R266.1 R265.1
N$322
  Bottom 0.61: D38.C 127.95,11.43 | 127.95,11.43 129.22,11.43 R268.2 | 127.95,11.43 R267.2 126.68,8.89 C104.+
N$323
  Bottom 0.61: T44.B 129.22,25.4 130.49,24.13 R268.1
N$324
  Bottom 0.61: SWPF1D.1 T44.E 129.54,27.94 133.03,24.45 R269.2
N$325
  Bottom 0.61: T45.E 133.03,11.43 R269.1
N$326
  Bottom 0.61: IC30.3 149.54,11.43 R270.1 R272.2
N$327
  Bottom 0.61: R271.1 IC30.4
N$328
  Bottom 0.61: R273.1 149.54,16.51 IC30.5 143.19,16.51 141.92,17.78 141.92,26.67 C103.1
N$329
  Bottom 0.61: D38.A TRGF4.1
N$330
  Bottom 0.61: R267.1 127.32,20.32 126.68,20.95 126.68,21.27 124.46,21.27 DCYF2D.1
N$331
  Bottom 0.61: SWPF2D.1 122.87,44.45 124.14,45.72 127.95,45.72 130.49,48.26 R276.1
N$333
  Bottom 0.61: IC32.2 133.03,44.45 | 133.03,44.45 131.76,44.45 R276.2 R274.2 R275.2 | R277.1 133.03,44.45
N$334
  Bottom 0.61: R279.2 133.03,53.34 R277.2 133.03,48.26 134.3,46.99 IC32.1
N$335
  Bottom 0.61: IC32.3 135.57,41.91 134.94,41.27 134.94,40.32 133.99,39.37 131.76,39.37 R278.2
N$336
  Bottom 0.61: R280.1 134.3,57.15 | 134.3,57.15 134.3,62.23 R279.1 | T46.B 134.3,57.15
N$337
  Bottom 0.61: R281.1 145.73,63.5 T48.B 140.65,63.5 | 140.65,63.5 T47.B | T46.E 140.65,63.5
N$338
  Bottom 0.61: T47.C 134.62,69.53 R282.1
N$339
  Bottom 0.61: T48.C 145.73,68.58 R283.1
N$340
  Bottom 0.61: R275.1 122.87,53.34 CF2D.1
N$341
  Bottom 0.61: 133.03,34.29 R293.1 127.95,33.02 125.41,30.48 R286.1 | 133.03,34.29 R284.2 | 133.03,34.29 IC32.6 138.11,34.29 139.38,35.56 139.38,48.26 136.84,50.8 R295.1
N$342
  Bottom 0.61: IC32.5 135.57,36.83 134.3,38.1 R285.1
N$343
  Bottom 0.61: R288.1 C105.2 R287.2 IC31.14
N$344
  Bottom 0.61: IC31.12 135.57,83.82 C106.1 131.76,81.28 130.49,82.55 130.49,86.36 Q7.C
N$345
  Bottom 0.61: IC31.16 136.84,69.85 137.16,69.53 R282.2
N$346
  Bottom 0.61: R290.2 145.73,96.52 144.46,97.79 C107.2 141.92,96.52 141.92,80.01 143.19,78.74 IC31.3 R291.1
N$347
  Bottom 0.61: Q8.C 148.27,76.2 152.08,80.01 C108.1 IC31.5
N$348
  Bottom 0.61: IC31.1 144.46,69.85 143.19,68.58 R283.2
N$349
  Bottom 0.61: R293.2 121.6,33.02 F4Q2.1
N$350
  Bottom 0.61: R294.2 F4Q3.1
N$351
  Bottom 0.61: R286.2 134.3,30.48 135.57,31.75 IC32.7 138.11,31.75 140.65,34.29 140.65,49.53 136.84,53.34 134.62,53.34 132.4,55.56 132.4,61.59 HP4.1 125.41,72.39 127.95,74.93 C105.1 127.95,77.47 126.68,78.74 R287.1
N$352
  Bottom 0.61: R289.1 125.41,87.63 F4Q1.1 125.41,90.17 | 125.41,90.17 BP4.1 | 125.41,90.17 Q7.B 133.03,90.17 134.3,91.44 134.3,93.98 R290.1 C107.1
N$353
  Bottom 0.61: Q8.B 150.81,72.39 R292.1 153.67,71.12 156.21,68.58 156.21,64.77 154.94,63.5 149.86,63.5 144.46,58.1 LP4.1 144.78,53.02 144.78,52.07 145.73,51.12 R295.2
N$354
  Bottom 0.61: R272.1 153.35,26.67 F4C.1
N$355
  Bottom 0.61: T45.C 133.03,5.08 134.3,3.81 141.92,3.81 IC30.1
N$356
  Bottom 0.61: C103.2 139.38,27.94 141.92,30.48 141.92,35.56 143.19,36.83 IC32.10
N$357
  Bottom 0.61: IC32.9 145.73,34.29 148.27,36.83 R297.1 R296.1
N$358
  Bottom 0.61: IC32.13 147.96,44.45 R299.1 148.59,44.45 R300.2 | 157.48,44.45 R307.2 R304.2 160.02,24.13 158.75,22.86 R305.2 | 157.48,44.45 R306.2 R300.2 | R300.2 151.13,44.45 | R303.2 157.48,44.45 | 157.48,44.45 157.48,58.42 160.02,60.96 R308.2 160.02,68.58 R309.2
N$359
  Bottom 0.61: IC32.14 146.05,46.99 148.27,49.21 R299.2 R298.1
N$360
  Bottom 0.61: R298.2 OUT.1
N$361
  Bottom 0.61: R305.1 M2A.1
N$362
  Bottom 0.61: R304.1 M2B.1
N$363
  Bottom 0.61: R303.1 M2C.1
N$366
  Bottom 0.61: R300.1 151.45,54.93 153.67,57.15 M2F.1
N$367
  Bottom 0.61: R306.1 154.94,55.88 156.21,57.15 156.21,60.96 M2G.1
N$368
  Bottom 0.61: M2H.1 R307.1
N$369
  Bottom 0.61: R308.1 M2I.1
N$370
  Bottom 0.61: R309.1 156.21,85.09 M2J.1

### Text on the board
tPlace: Filtered / Noise 1 | Filtered / Noise 2 | Mordent Design | Filtered / Noise 3 | Filtered / Noise 4 / & Mixer | uLE DRUM 1.0